# Altium project iMX53_BB_V1I2.PrjPcb (part 1 of 2)
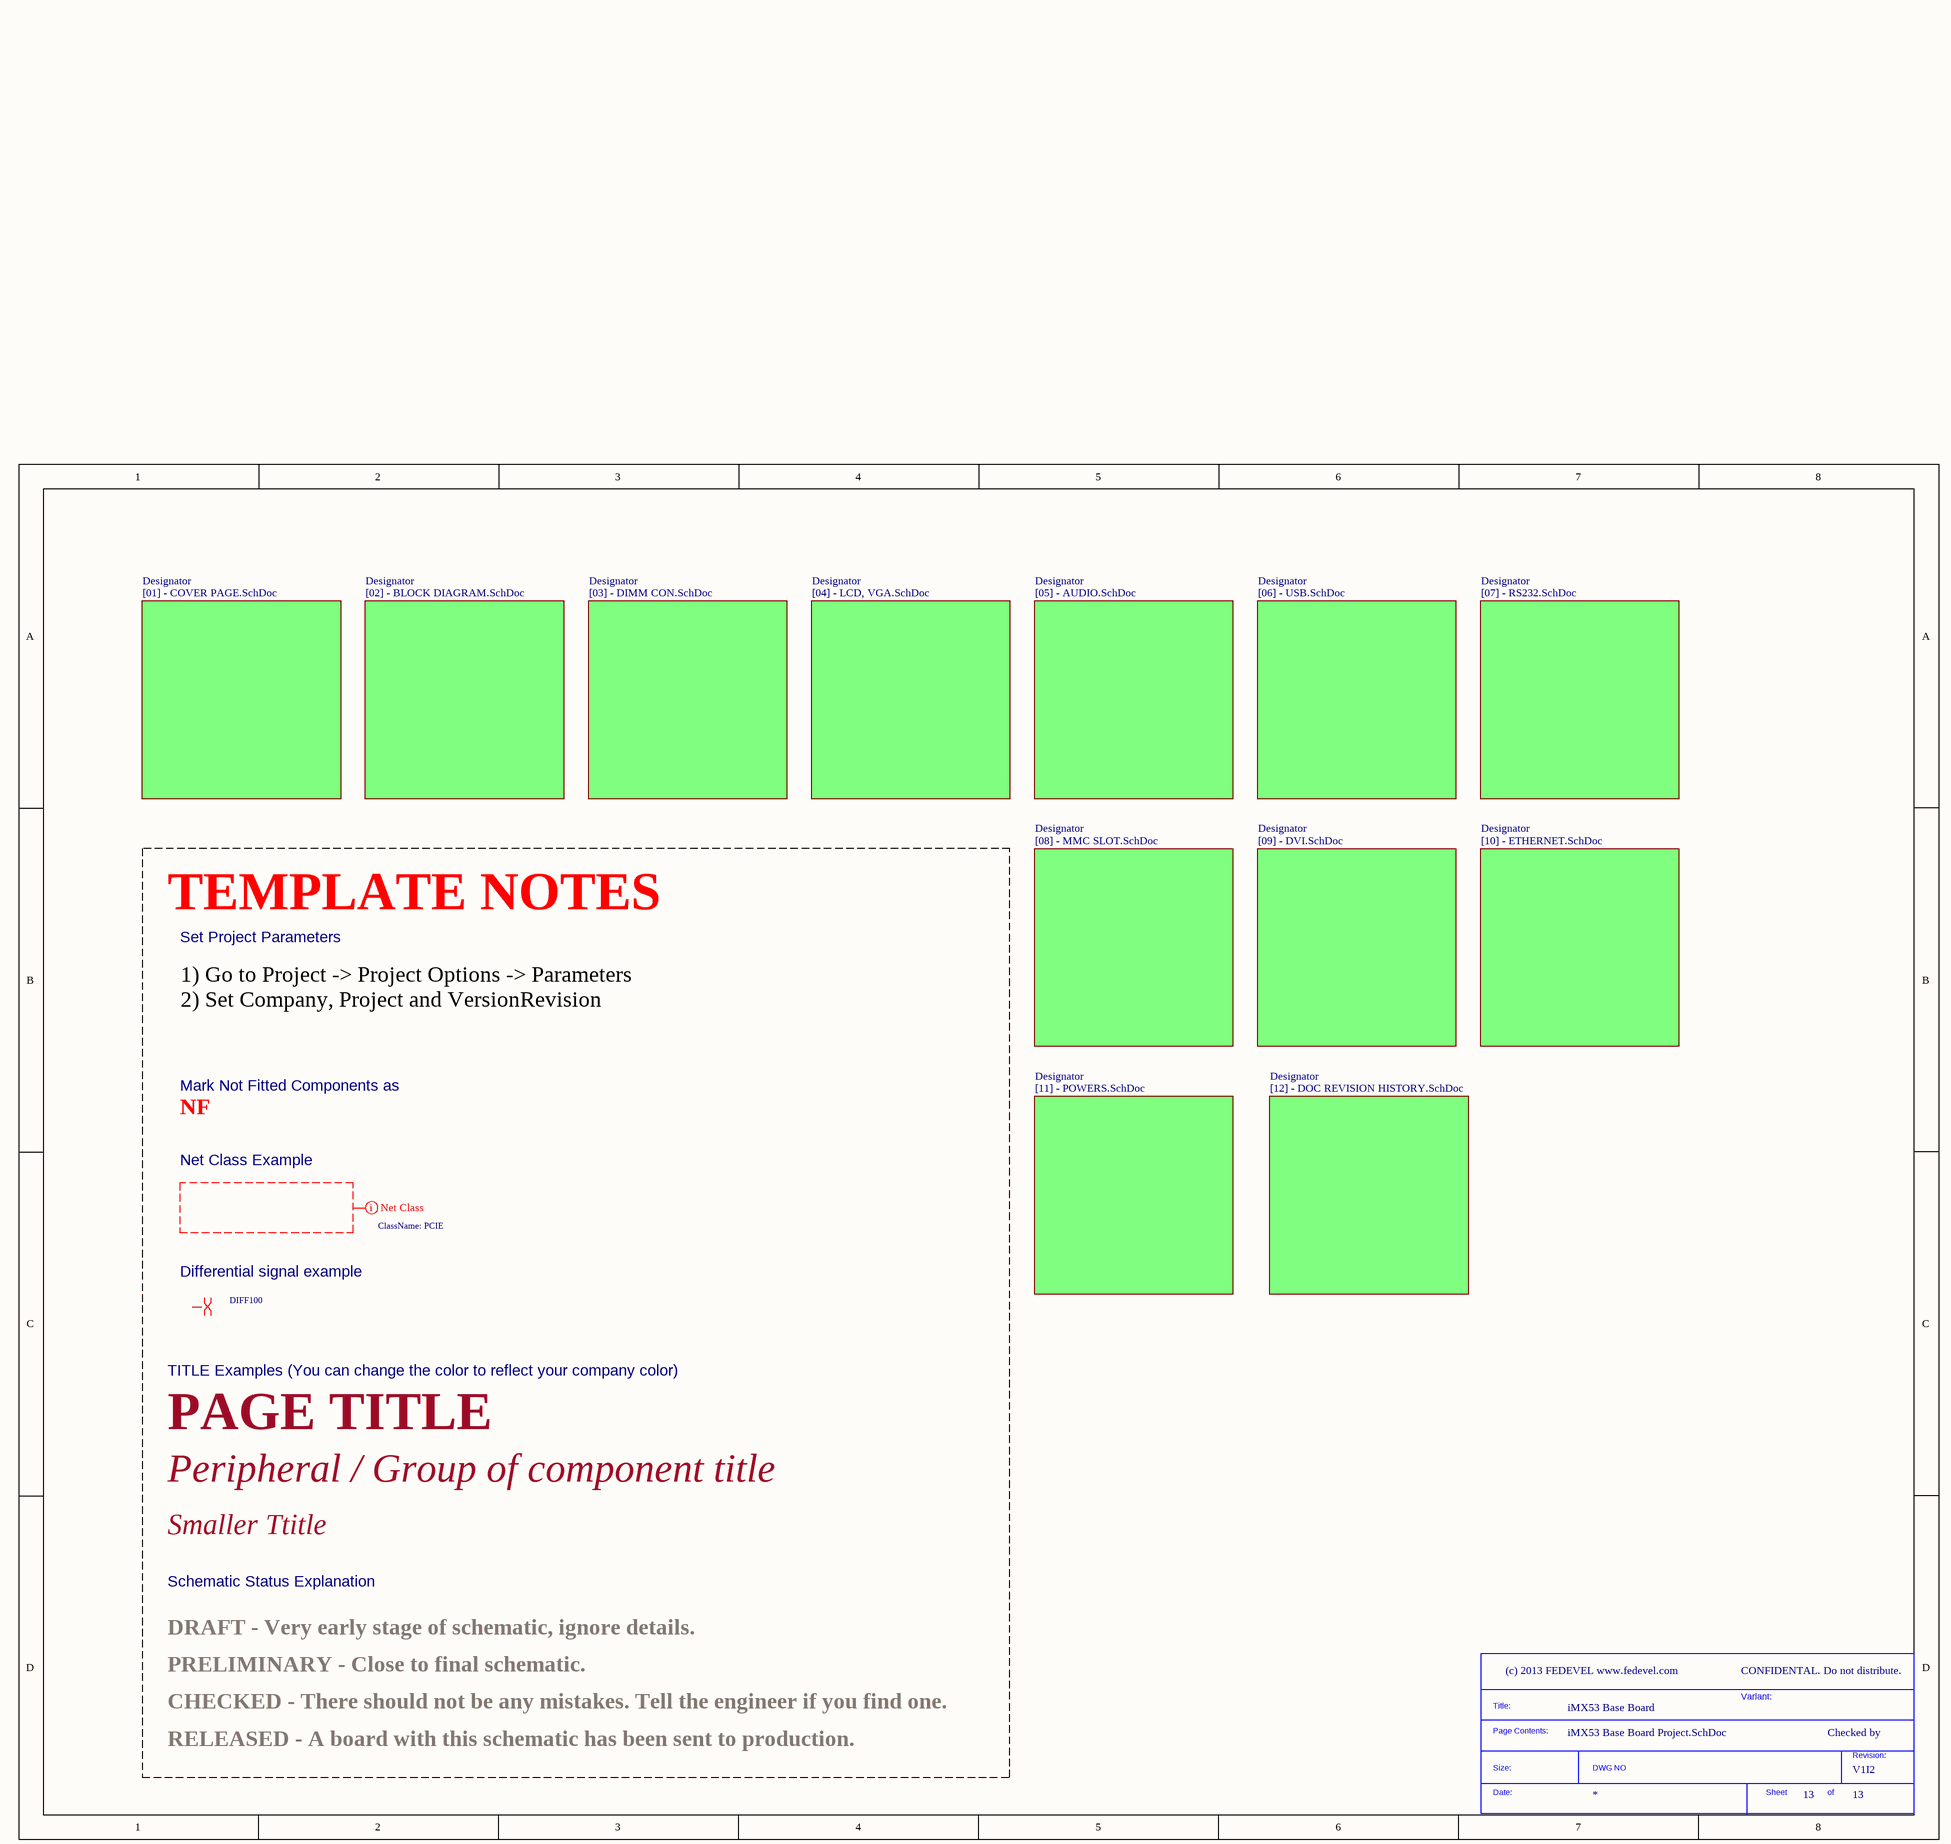
[diagram p0: iMX53 Base Board Project.SchDoc]
Company: (c) 2013 FEDEVEL www.fedevel.com; Project: iMX53 Base Board; VersionRevision: V1I2
13 sheets, 589 parts. Net scope: flat (ports and power ports of the same name join across sheets).
Board file: iMX53_BB_PCB_V1I2.PcbDoc
Sheets:
  iMX53 Base Board Project.SchDoc
    Designator = [01] - COVER PAGE.SchDoc
    Designator = [02] - BLOCK DIAGRAM.SchDoc
    Designator = [03] - DIMM CON.SchDoc
    Designator = [04] - LCD, VGA.SchDoc
    Designator = [05] - AUDIO.SchDoc
    Designator = [06] - USB.SchDoc
    Designator = [07] - RS232.SchDoc
    Designator = [08] - MMC SLOT.SchDoc
    Designator = [09] - DVI.SchDoc
    Designator = [10] - ETHERNET.SchDoc
    Designator = [11] - POWERS.SchDoc
    Designator = [12] - DOC REVISION HISTORY.SchDoc

## Sheet iMX53 Base Board Project.SchDoc
size A3; CompanyName: KDS; Organization: KDS; DocumentNumber: 13; Revision: V1I1; SheetNumber: 13; SheetTotal: 13; PageSetup: Record=PageOptions|CenterHorizontal=True|CenterVertical=True|PrintScale=1.07|XCorrection=1.00|YCorrection=1.00|PrintKind=1|BorderSize=5000000|LeftOffset=0|BottomOffset=0|Orientation=2|PaperLength=1000|PaperWidth=1000|Scale=100|PaperSource=7|PrintQuality=600|MediaType=1|DitherType=10|PaperKind=A3|PrintScaleMode=1; ProjectName: KDS C6A816x Module

### Parts
(Parts that share a designator on the sheet are numbered #1, #2 ... from top to bottom, then left to right.)
*#1  SDTitleBlock  (value not drawn)  (graphical)

### Sub-sheets
Designator = [01] - COVER PAGE.SchDoc: no entries
Designator = [02] - BLOCK DIAGRAM.SchDoc: no entries
Designator = [03] - DIMM CON.SchDoc: no entries
Designator = [04] - LCD, VGA.SchDoc: no entries
Designator = [05] - AUDIO.SchDoc: no entries
Designator = [06] - USB.SchDoc: no entries
Designator = [07] - RS232.SchDoc: no entries
Designator = [08] - MMC SLOT.SchDoc: no entries
Designator = [09] - DVI.SchDoc: no entries
Designator = [10] - ETHERNET.SchDoc: no entries
Designator = [11] - POWERS.SchDoc: no entries
Designator = [12] - DOC REVISION HISTORY.SchDoc: no entries

### Layout directives
net class PCIE: (no net found under the mark)
differential pair; net class DIFF100: (no net found under the mark)

### Notes on the sheet
- TEMPLATE NOTES
- Set Project Parameters
- 1) Go to Project -> Project Options -> Parameters
  2) Set Company, Project and VersionRevision
- NF
- Mark Not Fitted Components as
- Net Class Example
- Differential signal example
- TITLE Examples (You can change the color to reflect your company color)
- PAGE TITLE
- Peripheral / Group of component title
- Smaller Ttitle
- Schematic Status Explanation
- PRELIMINARY - Close to final schematic.
- DRAFT - Very early stage of schematic, ignore details.
- CONFIDENTAL. Do not distribute.
- CHECKED - There should not be any mistakes. Tell the engineer if you find one.
- Variant:
- Checked by
- RELEASED - A board with this schematic has been sent to production.
- (in symbol SDTitleBlock) Title:; Page Contents:; Revision:; Size:; DWG NO; Date:; Sheet; of

## Sheet [01] - COVER PAGE.SchDoc
size A3; DocumentNumber: 1; SheetNumber: 1; SheetTotal: 13
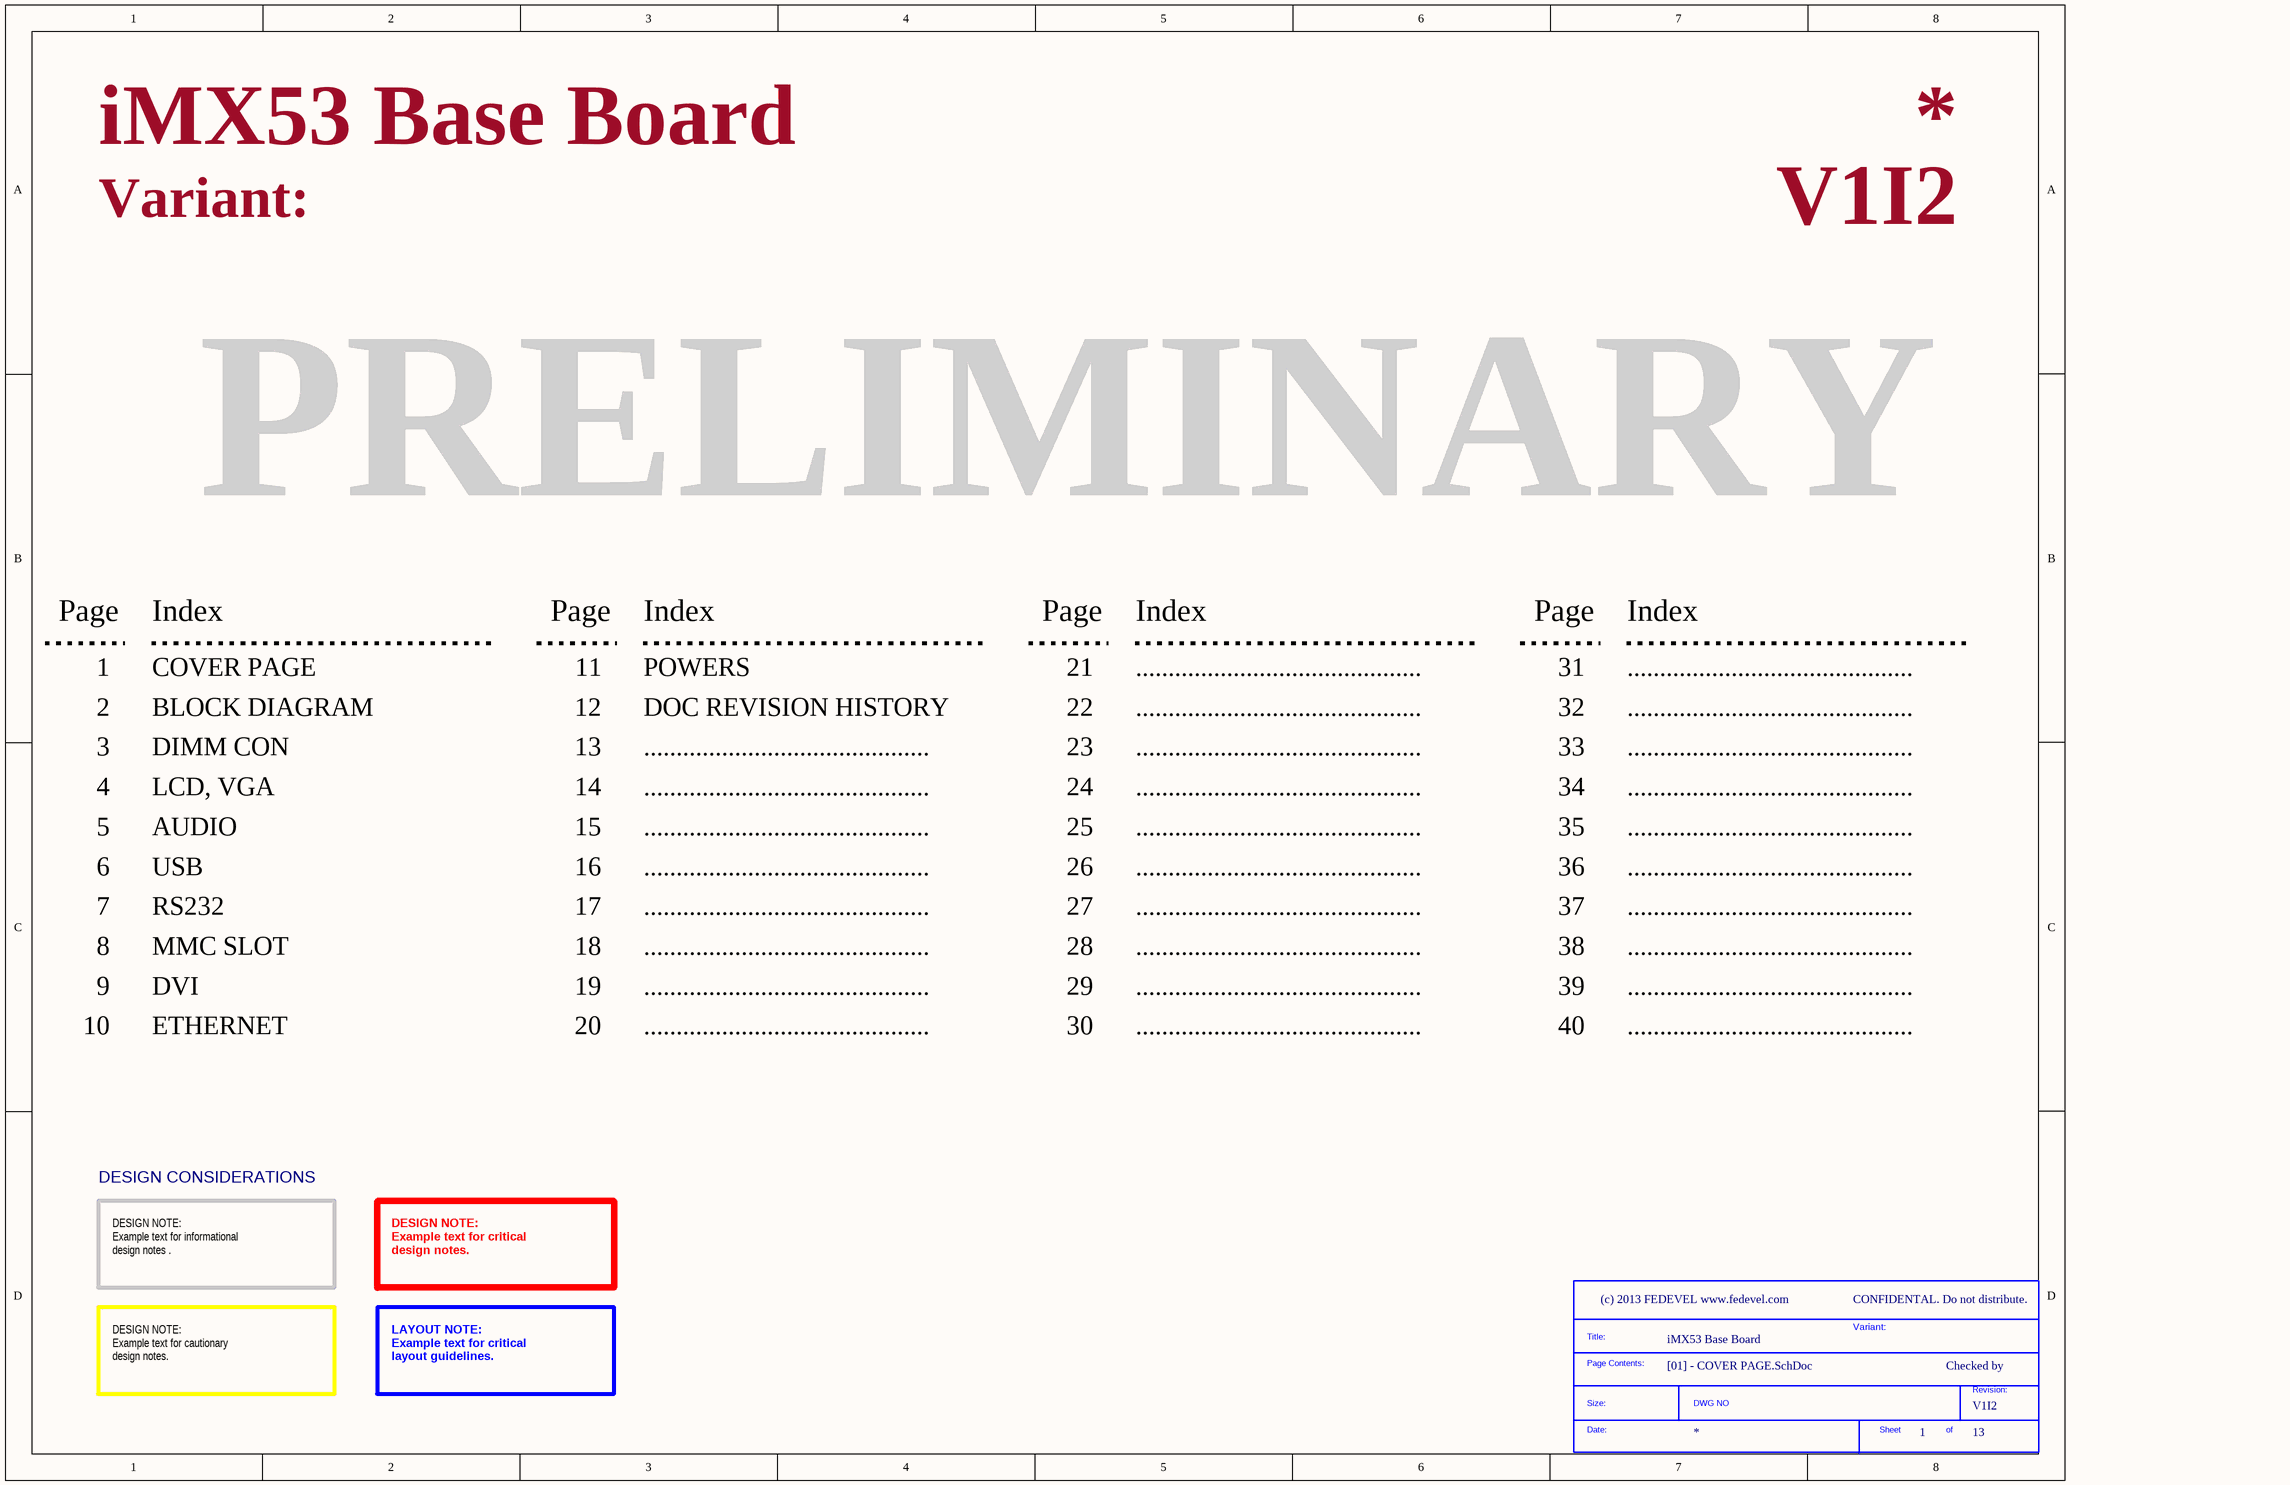
[diagram p1: [01] - COVER PAGE.SchDoc]

### Parts
(Parts that share a designator on the sheet are numbered #1, #2 ... from top to bottom, then left to right.)
*#2  SDTitleBlock  (value not drawn)  (graphical)

### Notes on the sheet
- Variant:
- PRELIMINARY
- Page
- Index
- 1
- COVER PAGE
- 11
- POWERS
- 21
- ............................................
- 31
- 2
- 3
- BLOCK DIAGRAM
- DIMM CON
- 12
- 13
- DOC REVISION HISTORY
- 22
- 23
- 32
- 33
- 4
- 5
- LCD, VGA
- AUDIO
- 14
- 15
- 24
- 25
- 34
- 35
- 6
- USB
- 16
- 26
- 36
- 7
- 8
- RS232
- MMC SLOT
- 17
- 18
- 27
- 28
- 37
- 38
- 9
- 10
- DVI
- ETHERNET
- 19
- 20
- 29
- 30
- 39
- 40
- DESIGN CONSIDERATIONS
- DESIGN NOTE:
  Example text for informational
  design notes .
- DESIGN NOTE:
  Example text for critical
  design notes.
- CONFIDENTAL. Do not distribute.
- Checked by
- DESIGN NOTE:
  Example text for cautionary
  design notes.
- LAYOUT NOTE:
  Example text for critical
  layout guidelines.
- (in symbol SDTitleBlock) Title:; Page Contents:; Revision:; Size:; DWG NO; Date:; Sheet; of

## Sheet [02] - BLOCK DIAGRAM.SchDoc
size A3; DocumentNumber: 2; SheetNumber: 2; SheetTotal: 13
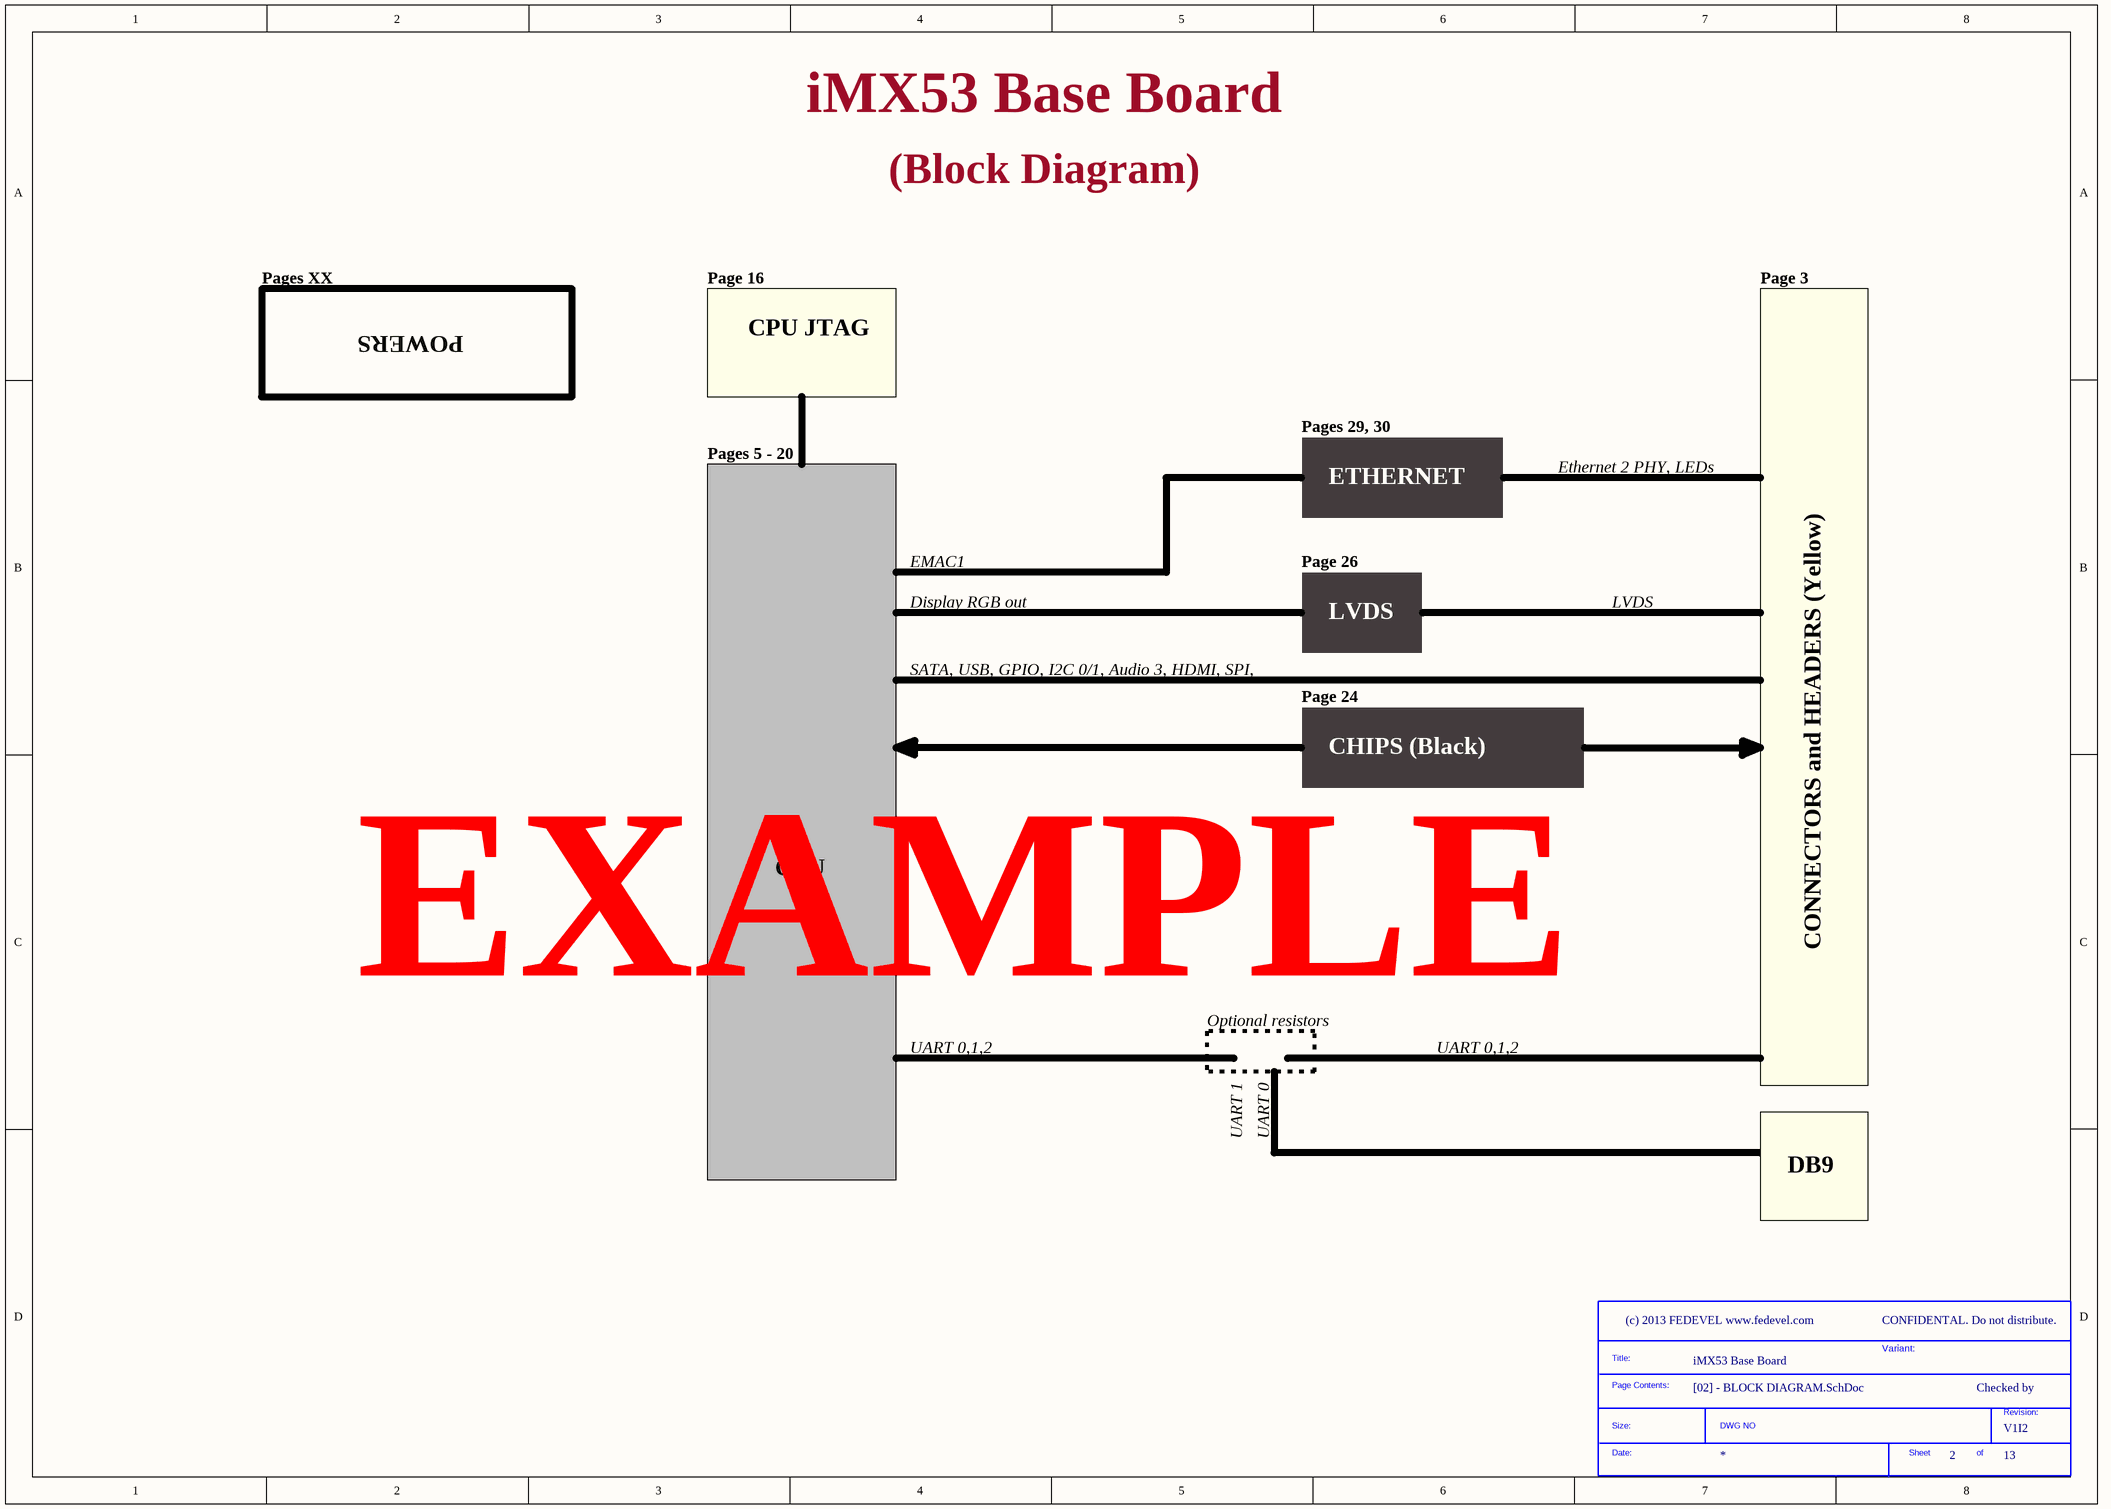
[diagram p2: [02] - BLOCK DIAGRAM.SchDoc]

### Parts
(Parts that share a designator on the sheet are numbered #1, #2 ... from top to bottom, then left to right.)
*#3  SDTitleBlock  (value not drawn)  (graphical)

### Notes on the sheet
- (Block Diagram)
- Pages XX
- Page 16
- Page 3
- POWERS
- CPU JTAG
- Pages 29, 30
- Pages 5 - 20
- ETHERNET
- Ethernet 2 PHY, LEDs
- EMAC1
- Page 26
- Display RGB out
- LVDS
- SATA, USB, GPIO, I2C 0/1, Audio 3, HDMI, SPI,
- Page 24
- CHIPS (Black)
- CPU
- CONNECTORS and HEADERS (Yellow)
- EXAMPLE
- UART 0,1,2
- Optional resistors
- FPGA
- UART 1
- UART 0
- DB9
- CONFIDENTAL. Do not distribute.
- CLOCKS (CPU & PCIE)
- Variant:
- Checked by
- (in symbol SDTitleBlock) Title:; Page Contents:; Revision:; Size:; DWG NO; Date:; Sheet; of

## Sheet [03] - DIMM CON.SchDoc: IMXBB
size A3; DocumentNumber: 3; Revision: 2.0; SheetNumber: 3; SheetTotal: 13
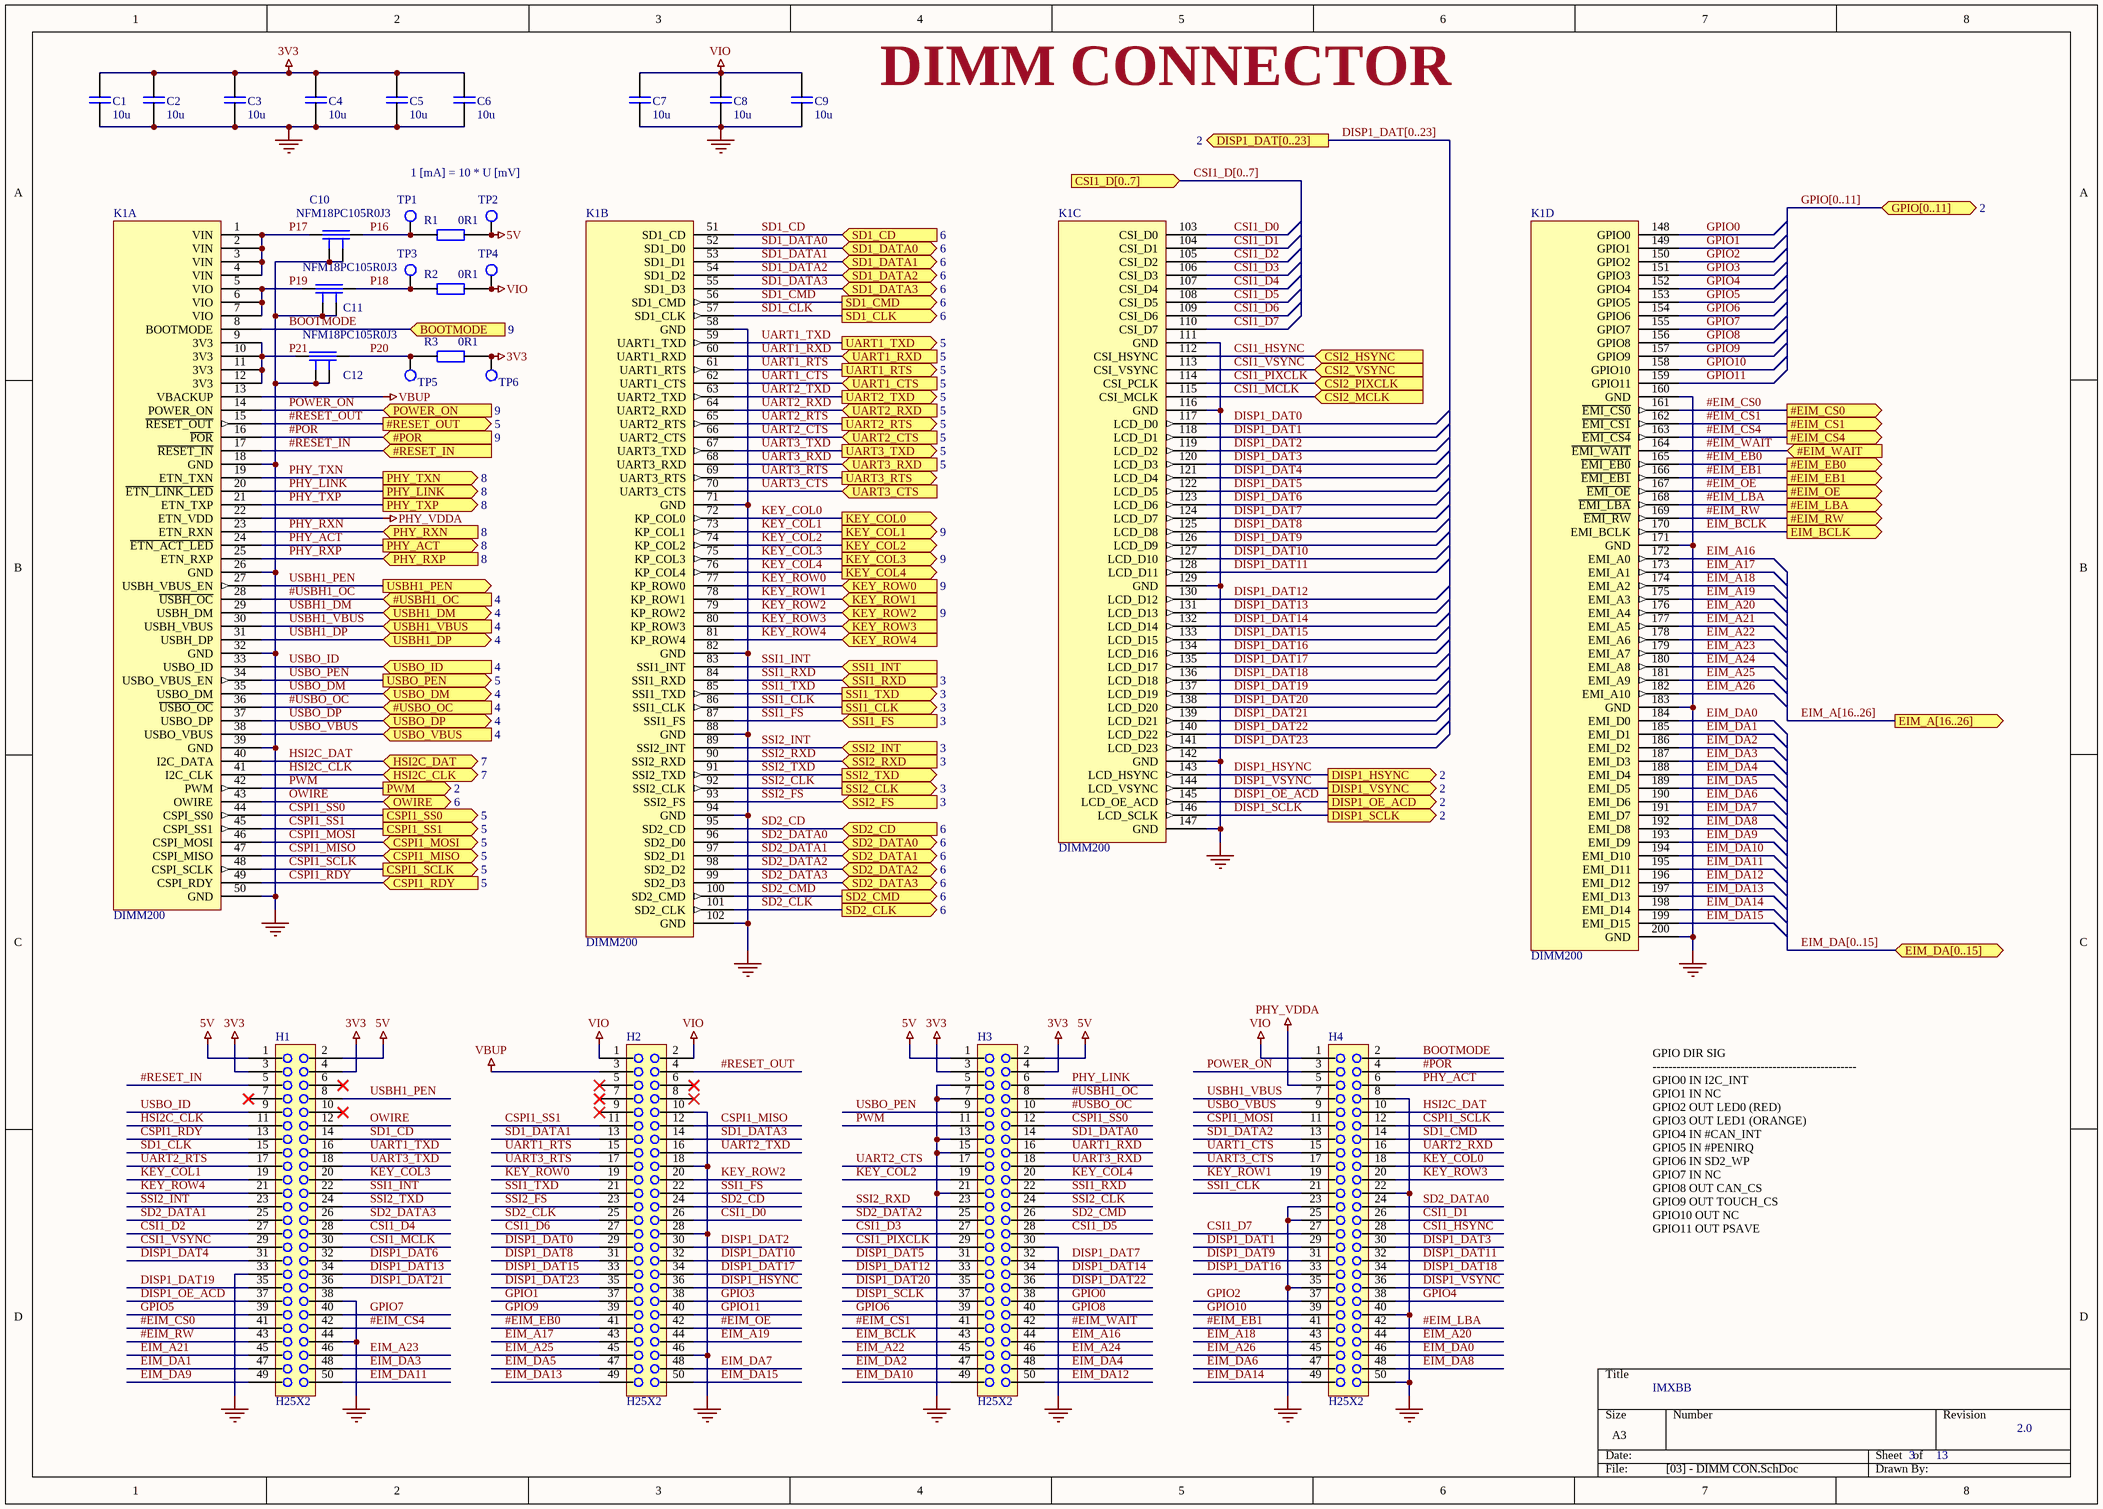
[diagram p3: [03] - DIMM CON.SchDoc]

### Parts
C1  10u  [0805]
C2  10u  [0805]
C3  10u  [0805]
C4  10u  [0805]
C5  10u  [0805]
C6  10u  [0805]
C7  10u  [0805]
C8  10u  [0805]
C9  10u  [0805]
C10  NFM18PC105R0J3  [NFM18P]
C11  NFM18PC105R0J3  [NFM18P]
C12  NFM18PC105R0J3  [NFM18P]
H1  H25X2  [H2x25]
H2  H25X2  [H2x25]
H3  H25X2  [H2x25]
H4  H25X2  [H2x25]
K1  DIMM200  [SODIMM200EDGE]  (parts A,B,C,D of 4)
R1  0R1  [0603]
R2  0R1  [0603]
R3  0R1  [0603]
TP1  TESTPOINT  [TESTPOINT_2mm]  (value not drawn)
TP2  TESTPOINT  [TESTPOINT_2mm]  (value not drawn)
TP3  TESTPOINT  [TESTPOINT_2mm]  (value not drawn)
TP4  TESTPOINT  [TESTPOINT_2mm]  (value not drawn)
TP5  TESTPOINT  [TESTPOINT_2mm]  (value not drawn)
TP6  TESTPOINT  [TESTPOINT_2mm]  (value not drawn)

### Ports
#EIM_CS0 (out), #EIM_CS1 (out), #EIM_CS4 (out), #EIM_EB0 (out), #EIM_EB1 (out), #EIM_LBA (out), #EIM_OE (out), #EIM_RW (out), #EIM_WAIT (in), #POR (in, see 9), #RESET_IN (in), #RESET_OUT (out, see 5), #USBH1_OC (in, see 4), #USBO_OC (in, see 4), BOOTMODE (in, see 9), CSI1_D[0..7] (in), CSI2_HSYNC (in), CSI2_MCLK (in), CSI2_PIXCLK (in), CSI2_VSYNC (in), CSPI1_MISO (bidir, see 5), CSPI1_MOSI (bidir, see 5), CSPI1_RDY (in, see 5), CSPI1_SCLK (out, see 5), CSPI1_SS0 (out, see 5), CSPI1_SS1 (out, see 5), DISP1_DAT[0..23] (out, see 2), DISP1_HSYNC (out, see 2), DISP1_OE_ACD (out, see 2), DISP1_SCLK (out, see 2), DISP1_VSYNC (out, see 2), EIM_A[16..26] (out), EIM_BCLK (out), EIM_DA[0..15] (bidir), GPIO[0..11] (bidir, see 2), HSI2C_CLK (bidir, see 7), HSI2C_DAT (bidir, see 7), KEY_COL0 (out), KEY_COL1 (out, see 9), KEY_COL2 (out), KEY_COL3 (out, see 9), KEY_COL4 (out), KEY_ROW0 (in, see 9), KEY_ROW1 (in), KEY_ROW2 (in, see 9), KEY_ROW3 (in), KEY_ROW4 (in), OWIRE (bidir, see 6), PHY_ACT (out, see 8), PHY_LINK (out, see 8), PHY_RXN (in, see 8), PHY_RXP (in, see 8), PHY_TXN (out, see 8), PHY_TXP (out, see 8), POWER_ON (in, see 9), PWM (out, see 2), SD1_CD (in, see 6), SD1_CLK (out, see 6), SD1_CMD (out, see 6), SD1_DATA0 (bidir, see 6), SD1_DATA1 (bidir, see 6), SD1_DATA2 (bidir, see 6), SD1_DATA3 (bidir, see 6), SD2_CD (in, see 6), SD2_CLK (out, see 6), SD2_CMD (out, see 6), SD2_DATA0 (bidir, see 6), SD2_DATA1 (bidir, see 6), SD2_DATA2 (bidir, see 6), SD2_DATA3 (bidir, see 6), SSI1_CLK (out, see 3), SSI1_FS (in, see 3), SSI1_INT (in), SSI1_RXD (in, see 3), SSI1_TXD (out, see 3), SSI2_CLK (out, see 3), SSI2_FS (in, see 3), SSI2_INT (in, see 3), SSI2_RXD (in, see 3), SSI2_TXD (out), UART1_CTS (in, see 5), UART1_RTS (out, see 5), UART1_RXD (in, see 5), UART1_TXD (out, see 5), UART2_CTS (in, see 5), UART2_RTS (out, see 5), UART2_RXD (in, see 5), UART2_TXD (out, see 5), UART3_CTS (in), UART3_RTS (out), UART3_RXD (in, see 5), UART3_TXD (out, see 5), USBH1_DM (bidir, see 4), USBH1_DP (bidir, see 4), USBH1_PEN (out), USBH1_VBUS (in, see 4), USBO_DM (bidir, see 4), USBO_DP (bidir, see 4), USBO_ID (in, see 4), USBO_PEN (out, see 5), USBO_VBUS (in, see 4)

### Nets
3V3: C1.2 C2.2 C3.2 C4.2 C5.2 C6.2 H1.3 H1.4 H3.3 H3.4 R3.2 TP6.1
5V: H1.1 H1.2 H3.1 H3.2 R1.2 TP2.1
GND: C1.1 C2.1 C3.1 C4.1 C5.1 C6.1 C7.1 C8.1 C9.1 C10.2 C10.4 C11.2 C11.4 C12.2 C12.4 H1.33 H1.38 H1.44 H2.10 H2.18 H2.28 H2.46 H3.5 H3.7 H3.13 H3.15 H3.21 H3.30 H4.8 H4.22 H4.23 H4.25 H4.35 H4.40 H4.50 K1.18(GND) K1.26(GND) K1.32(GND) K1.39(GND) K1.50(GND) K1.58(GND) K1.71(GND) K1.82(GND) K1.88(GND) K1.94(GND) K1.102(GND) K1.111(GND) K1.116(GND) K1.129(GND) K1.142(GND) K1.147(GND) K1.160(GND) K1.171(GND) K1.183(GND) K1.200(GND)
PHY_VDDA: H4.5 K1.22(ETN_VDD)
VBUP: H2.3 K1.13(VBACKUP)
VIO: C7.2 C8.2 C9.2 H2.1 H2.2 H4.1 R2.2 TP4.1
#EIM_CS0: H1.41 K1.161(~{EMI_CS0}) ; port #EIM_CS0
#EIM_CS1: H3.41 K1.162(~{EMI_CS1}) ; port #EIM_CS1
#EIM_CS4: H1.42 K1.163(~{EMI_CS4}) ; port #EIM_CS4
#EIM_EB0: H2.41 K1.165(~{EMI_EB0}) ; port #EIM_EB0
#EIM_EB1: H4.41 K1.166(~{EMI_EB1}) ; port #EIM_EB1
#EIM_LBA: H4.42 K1.168(~{EMI_LBA}) ; port #EIM_LBA
#EIM_OE: H2.42 K1.167(~{EMI_OE}) ; port #EIM_OE
#EIM_RW: H1.43 K1.169(~{EMI_RW}) ; port #EIM_RW
#EIM_WAIT: H3.42 K1.164(~{EMI_WAIT}) ; port #EIM_WAIT
#POR: H4.4 K1.16(~{POR}) ; port #POR
#RESET_IN: H1.5 K1.17(~{RESET_IN}) ; port #RESET_IN
#RESET_OUT: H2.4 K1.15(~{RESET_OUT}) ; port #RESET_OUT
#USBH1_OC: H3.8 K1.28(~{USBH_OC}) ; port #USBH1_OC
#USBO_OC: H3.10 K1.36(~{USBO_OC}) ; port #USBO_OC
BOOTMODE: H4.2 K1.8(BOOTMODE) ; port BOOTMODE
CSI1_D0: H2.26 K1.103(CSI_D0)
CSI1_D1: H4.26 K1.104(CSI_D1)
CSI1_D2: H1.27 K1.105(CSI_D2)
CSI1_D3: H3.27 K1.106(CSI_D3)
CSI1_D4: H1.28 K1.107(CSI_D4)
CSI1_D5: H3.28 K1.108(CSI_D5)
CSI1_D6: H2.27 K1.109(CSI_D6)
CSI1_D7: H4.27 K1.110(CSI_D7)
CSI1_HSYNC: H4.28 K1.112(CSI_HSYNC) ; port CSI2_HSYNC
CSI1_MCLK: H1.30 K1.115(CSI_MCLK) ; port CSI2_MCLK
CSI1_PIXCLK: H3.29 K1.114(CSI_PCLK) ; port CSI2_PIXCLK
CSI1_VSYNC: H1.29 K1.113(CSI_VSYNC) ; port CSI2_VSYNC
CSPI1_MISO: H2.12 K1.47(CSPI_MISO) ; port CSPI1_MISO
CSPI1_MOSI: H4.11 K1.46(CSPI_MOSI) ; port CSPI1_MOSI
CSPI1_RDY: H1.13 K1.49(CSPI_RDY) ; port CSPI1_RDY
CSPI1_SCLK: H4.12 K1.48(CSPI_SCLK) ; port CSPI1_SCLK
CSPI1_SS0: H3.12 K1.44(CSPI_SS0) ; port CSPI1_SS0
CSPI1_SS1: H2.11 K1.45(CSPI_SS1) ; port CSPI1_SS1
DISP1_DAT0: H2.29 K1.117(LCD_D0)
DISP1_DAT1: H4.29 K1.118(LCD_D1)
DISP1_DAT2: H2.30 K1.119(LCD_D2)
DISP1_DAT3: H4.30 K1.120(LCD_D3)
DISP1_DAT4: H1.31 K1.121(LCD_D4)
DISP1_DAT5: H3.31 K1.122(LCD_D5)
DISP1_DAT6: H1.32 K1.123(LCD_D6)
DISP1_DAT7: H3.32 K1.124(LCD_D7)
DISP1_DAT8: H2.31 K1.125(LCD_D8)
DISP1_DAT9: H4.31 K1.126(LCD_D9)
DISP1_DAT10: H2.32 K1.127(LCD_D10)
DISP1_DAT11: H4.32 K1.128(LCD_D11)
DISP1_DAT12: H3.33 K1.130(LCD_D12)
DISP1_DAT13: H1.34 K1.131(LCD_D13)
DISP1_DAT14: H3.34 K1.132(LCD_D14)
DISP1_DAT15: H2.33 K1.133(LCD_D15)
DISP1_DAT16: H4.33 K1.134(LCD_D16)
DISP1_DAT17: H2.34 K1.135(LCD_D17)
DISP1_DAT18: H4.34 K1.136(LCD_D18)
DISP1_DAT19: H1.35 K1.137(LCD_D19)
DISP1_DAT20: H3.35 K1.138(LCD_D20)
DISP1_DAT21: H1.36 K1.139(LCD_D21)
DISP1_DAT22: H3.36 K1.140(LCD_D22)
DISP1_DAT23: H2.35 K1.141(LCD_D23)
DISP1_HSYNC: H2.36 K1.143(LCD_HSYNC) ; port DISP1_HSYNC
DISP1_OE_ACD: H1.37 K1.145(LCD_OE_ACD) ; port DISP1_OE_ACD
DISP1_SCLK: H3.37 K1.146(LCD_SCLK) ; port DISP1_SCLK
DISP1_VSYNC: H4.36 K1.144(LCD_VSYNC) ; port DISP1_VSYNC
EIM_A16: H3.44 K1.172(EMI_A0)
EIM_A17: H2.43 K1.173(EMI_A1)
EIM_A18: H4.43 K1.174(EMI_A2)
EIM_A19: H2.44 K1.175(EMI_A3)
EIM_A20: H4.44 K1.176(EMI_A4)
EIM_A21: H1.45 K1.177(EMI_A5)
EIM_A22: H3.45 K1.178(EMI_A6)
EIM_A23: H1.46 K1.179(EMI_A7)
EIM_A24: H3.46 K1.180(EMI_A8)
EIM_A25: H2.45 K1.181(EMI_A9)
EIM_A26: H4.45 K1.182(EMI_A10)
EIM_BCLK: H3.43 K1.170(EMI_BCLK) ; port EIM_BCLK
EIM_DA0: H4.46 K1.184(EMI_D0)
EIM_DA1: H1.47 K1.185(EMI_D1)
EIM_DA2: H3.47 K1.186(EMI_D2)
EIM_DA3: H1.48 K1.187(EMI_D3)
EIM_DA4: H3.48 K1.188(EMI_D4)
EIM_DA5: H2.47 K1.189(EMI_D5)
EIM_DA6: H4.47 K1.190(EMI_D6)
EIM_DA7: H2.48 K1.191(EMI_D7)
EIM_DA8: H4.48 K1.192(EMI_D8)
EIM_DA9: H1.49 K1.193(EMI_D9)
EIM_DA10: H3.49 K1.194(EMI_D10)
EIM_DA11: H1.50 K1.195(EMI_D11)
EIM_DA12: H3.50 K1.196(EMI_D12)
EIM_DA13: H2.49 K1.197(EMI_D13)
EIM_DA14: H4.49 K1.198(EMI_D14)
EIM_DA15: H2.50 K1.199(EMI_D15)
GPIO0: H3.38 K1.148(GPIO0)
GPIO1: H2.37 K1.149(GPIO1)
GPIO2: H4.37 K1.150(GPIO2)
GPIO3: H2.38 K1.151(GPIO3)
GPIO4: H4.38 K1.152(GPIO4)
GPIO5: H1.39 K1.153(GPIO5)
GPIO6: H3.39 K1.154(GPIO6)
GPIO7: H1.40 K1.155(GPIO7)
GPIO8: H3.40 K1.156(GPIO8)
GPIO9: H2.39 K1.157(GPIO9)
GPIO10: H4.39 K1.158(GPIO10)
GPIO11: H2.40 K1.159(GPIO11)
HSI2C_CLK: H1.11 K1.41(I2C_CLK) ; port HSI2C_CLK
HSI2C_DAT: H4.10 K1.40(I2C_DATA) ; port HSI2C_DAT
KEY_COL0: H4.18 K1.72(KP_COL0) ; port KEY_COL0
KEY_COL1: H1.19 K1.73(KP_COL1) ; port KEY_COL1
KEY_COL2: H3.19 K1.74(KP_COL2) ; port KEY_COL2
KEY_COL3: H1.20 K1.75(KP_COL3) ; port KEY_COL3
KEY_COL4: H3.20 K1.76(KP_COL4) ; port KEY_COL4
KEY_ROW0: H2.19 K1.77(KP_ROW0) ; port KEY_ROW0
KEY_ROW1: H4.19 K1.78(KP_ROW1) ; port KEY_ROW1
KEY_ROW2: H2.20 K1.79(KP_ROW2) ; port KEY_ROW2
KEY_ROW3: H4.20 K1.80(KP_ROW3) ; port KEY_ROW3
KEY_ROW4: H1.21 K1.81(KP_ROW4) ; port KEY_ROW4
OWIRE: H1.12 K1.43(OWIRE) ; port OWIRE
P16: C10.3 R1.1 TP1.1
P17: C10.1 K1.1(VIN) K1.2(VIN) K1.3(VIN) K1.4(VIN)
P18: C11.3 R2.1 TP3.1
P19: C11.1 K1.5(VIO) K1.6(VIO) K1.7(VIO)
P20: C12.3 R3.1 TP5.1
P21: C12.1 K1.9(3V3) K1.10(3V3) K1.11(3V3) K1.12(3V3)
PHY_ACT: H4.6 K1.24(~{ETN_ACT_LED}) ; port PHY_ACT
PHY_LINK: H3.6 K1.20(~{ETN_LINK_LED}) ; port PHY_LINK
PHY_RXN: K1.23(ETN_RXN) ; port PHY_RXN
PHY_RXP: K1.25(ETN_RXP) ; port PHY_RXP
PHY_TXN: K1.19(ETN_TXN) ; port PHY_TXN
PHY_TXP: K1.21(ETN_TXP) ; port PHY_TXP
POWER_ON: H4.3 K1.14(POWER_ON) ; port POWER_ON
PWM: H3.11 K1.42(PWM) ; port PWM
SD1_CD: H1.14 K1.51(SD1_CD) ; port SD1_CD
SD1_CLK: H1.15 K1.57(SD1_CLK) ; port SD1_CLK
SD1_CMD: H4.14 K1.56(SD1_CMD) ; port SD1_CMD
SD1_DATA0: H3.14 K1.52(SD1_D0) ; port SD1_DATA0
SD1_DATA1: H2.13 K1.53(SD1_D1) ; port SD1_DATA1
SD1_DATA2: H4.13 K1.54(SD1_D2) ; port SD1_DATA2
SD1_DATA3: H2.14 K1.55(SD1_D3) ; port SD1_DATA3
SD2_CD: H2.24 K1.95(SD2_CD) ; port SD2_CD
SD2_CLK: H2.25 K1.101(SD2_CLK) ; port SD2_CLK
SD2_CMD: H3.26 K1.100(SD2_CMD) ; port SD2_CMD
SD2_DATA0: H4.24 K1.96(SD2_D0) ; port SD2_DATA0
SD2_DATA1: H1.25 K1.97(SD2_D1) ; port SD2_DATA1
SD2_DATA2: H3.25 K1.98(SD2_D2) ; port SD2_DATA2
SD2_DATA3: H1.26 K1.99(SD2_D3) ; port SD2_DATA3
SSI1_CLK: H4.21 K1.86(SSI1_CLK) ; port SSI1_CLK
SSI1_FS: H2.22 K1.87(SSI1_FS) ; port SSI1_FS
SSI1_INT: H1.22 K1.83(SSI1_INT) ; port SSI1_INT
SSI1_RXD: H3.22 K1.84(SSI1_RXD) ; port SSI1_RXD
SSI1_TXD: H2.21 K1.85(SSI1_TXD) ; port SSI1_TXD
SSI2_CLK: H3.24 K1.92(SSI2_CLK) ; port SSI2_CLK
SSI2_FS: H2.23 K1.93(SSI2_FS) ; port SSI2_FS
SSI2_INT: H1.23 K1.89(SSI2_INT) ; port SSI2_INT
SSI2_RXD: H3.23 K1.90(SSI2_RXD) ; port SSI2_RXD
SSI2_TXD: H1.24 K1.91(SSI2_TXD) ; port SSI2_TXD
UART1_CTS: H4.15 K1.62(UART1_CTS) ; port UART1_CTS
UART1_RTS: H2.15 K1.61(UART1_RTS) ; port UART1_RTS
UART1_RXD: H3.16 K1.60(UART1_RXD) ; port UART1_RXD
UART1_TXD: H1.16 K1.59(UART1_TXD) ; port UART1_TXD
UART2_CTS: H3.17 K1.66(UART2_CTS) ; port UART2_CTS
UART2_RTS: H1.17 K1.65(UART2_RTS) ; port UART2_RTS
UART2_RXD: H4.16 K1.64(UART2_RXD) ; port UART2_RXD
UART2_TXD: H2.16 K1.63(UART2_TXD) ; port UART2_TXD
UART3_CTS: H4.17 K1.70(UART3_CTS) ; port UART3_CTS
UART3_RTS: H2.17 K1.69(UART3_RTS) ; port UART3_RTS
UART3_RXD: H3.18 K1.68(UART3_RXD) ; port UART3_RXD
UART3_TXD: H1.18 K1.67(UART3_TXD) ; port UART3_TXD
USBH1_DM: K1.29(USBH_DM) ; port USBH1_DM
USBH1_DP: K1.31(USBH_DP) ; port USBH1_DP
USBH1_PEN: H1.8 K1.27(USBH_VBUS_EN) ; port USBH1_PEN
USBH1_VBUS: H4.7 K1.30(USBH_VBUS) ; port USBH1_VBUS
USBO_DM: K1.35(USBO_DM) ; port USBO_DM  [project net USBO_D_N]
USBO_DP: K1.37(USBO_DP) ; port USBO_DP  [project net USBO_D_P]
USBO_ID: H1.9 K1.33(USBO_ID) ; port USBO_ID
USBO_PEN: H3.9 K1.34(USBO_VBUS_EN) ; port USBO_PEN
USBO_VBUS: H4.9 K1.38(USBO_VBUS) ; port USBO_VBUS

Not connected (* = marked no-connect by the designer): H1 6* 7* 10*; H2 5* 6* 7* 8* 9*

### Buses and harness runs
bus CSI1_D[0..7] = port CSI1_D[0..7]
bus DISP1_DAT[0..23] = port DISP1_DAT[0..23]
bus EIM_A[16..26] = port EIM_A[16..26]
bus EIM_DA[0..15] = port EIM_DA[0..15]
bus GPIO[0..11] = port GPIO[0..11]

### Notes on the sheet
- DIMM CONNECTOR
- 1 [mA] = 10 * U [mV]
- GPIO	DIR	SIG
  ---------------------------------------------------
  GPIO0	IN	I2C_INT
  GPIO1	IN	NC
  GPIO2	OUT	LED0 (RED)
  GPIO3	OUT	LED1 (ORANGE)
  GPIO4	IN	#CAN_INT
  GPIO5	IN	#PENIRQ
  GPIO6	IN	SD2_WP
  GPIO7	IN	NC
  GPIO8	OUT	CAN_CS
  GPIO9	OUT	TOUCH_CS
  GPIO10	OUT	NC
  GPIO11	OUT	PSAVE

### Library data of the parts
C1-C9 = C
C10-C12 = NFL21S: Chip EMIFIL; Producer: Murata; Order number: NFM18PC105R0J3; Component class: C; Assembly type: SMT
R1-R3 = R
TP1-TP6 = TESTPOINT: Testpoint pad; Order number: no component; Component class: TP; Producer: n/a; Assembly type: no component

## Sheet [04] - LCD, VGA.SchDoc: IMXBB
size A3; DocumentNumber: 4; Revision: 2.0; SheetNumber: 4; SheetTotal: 13
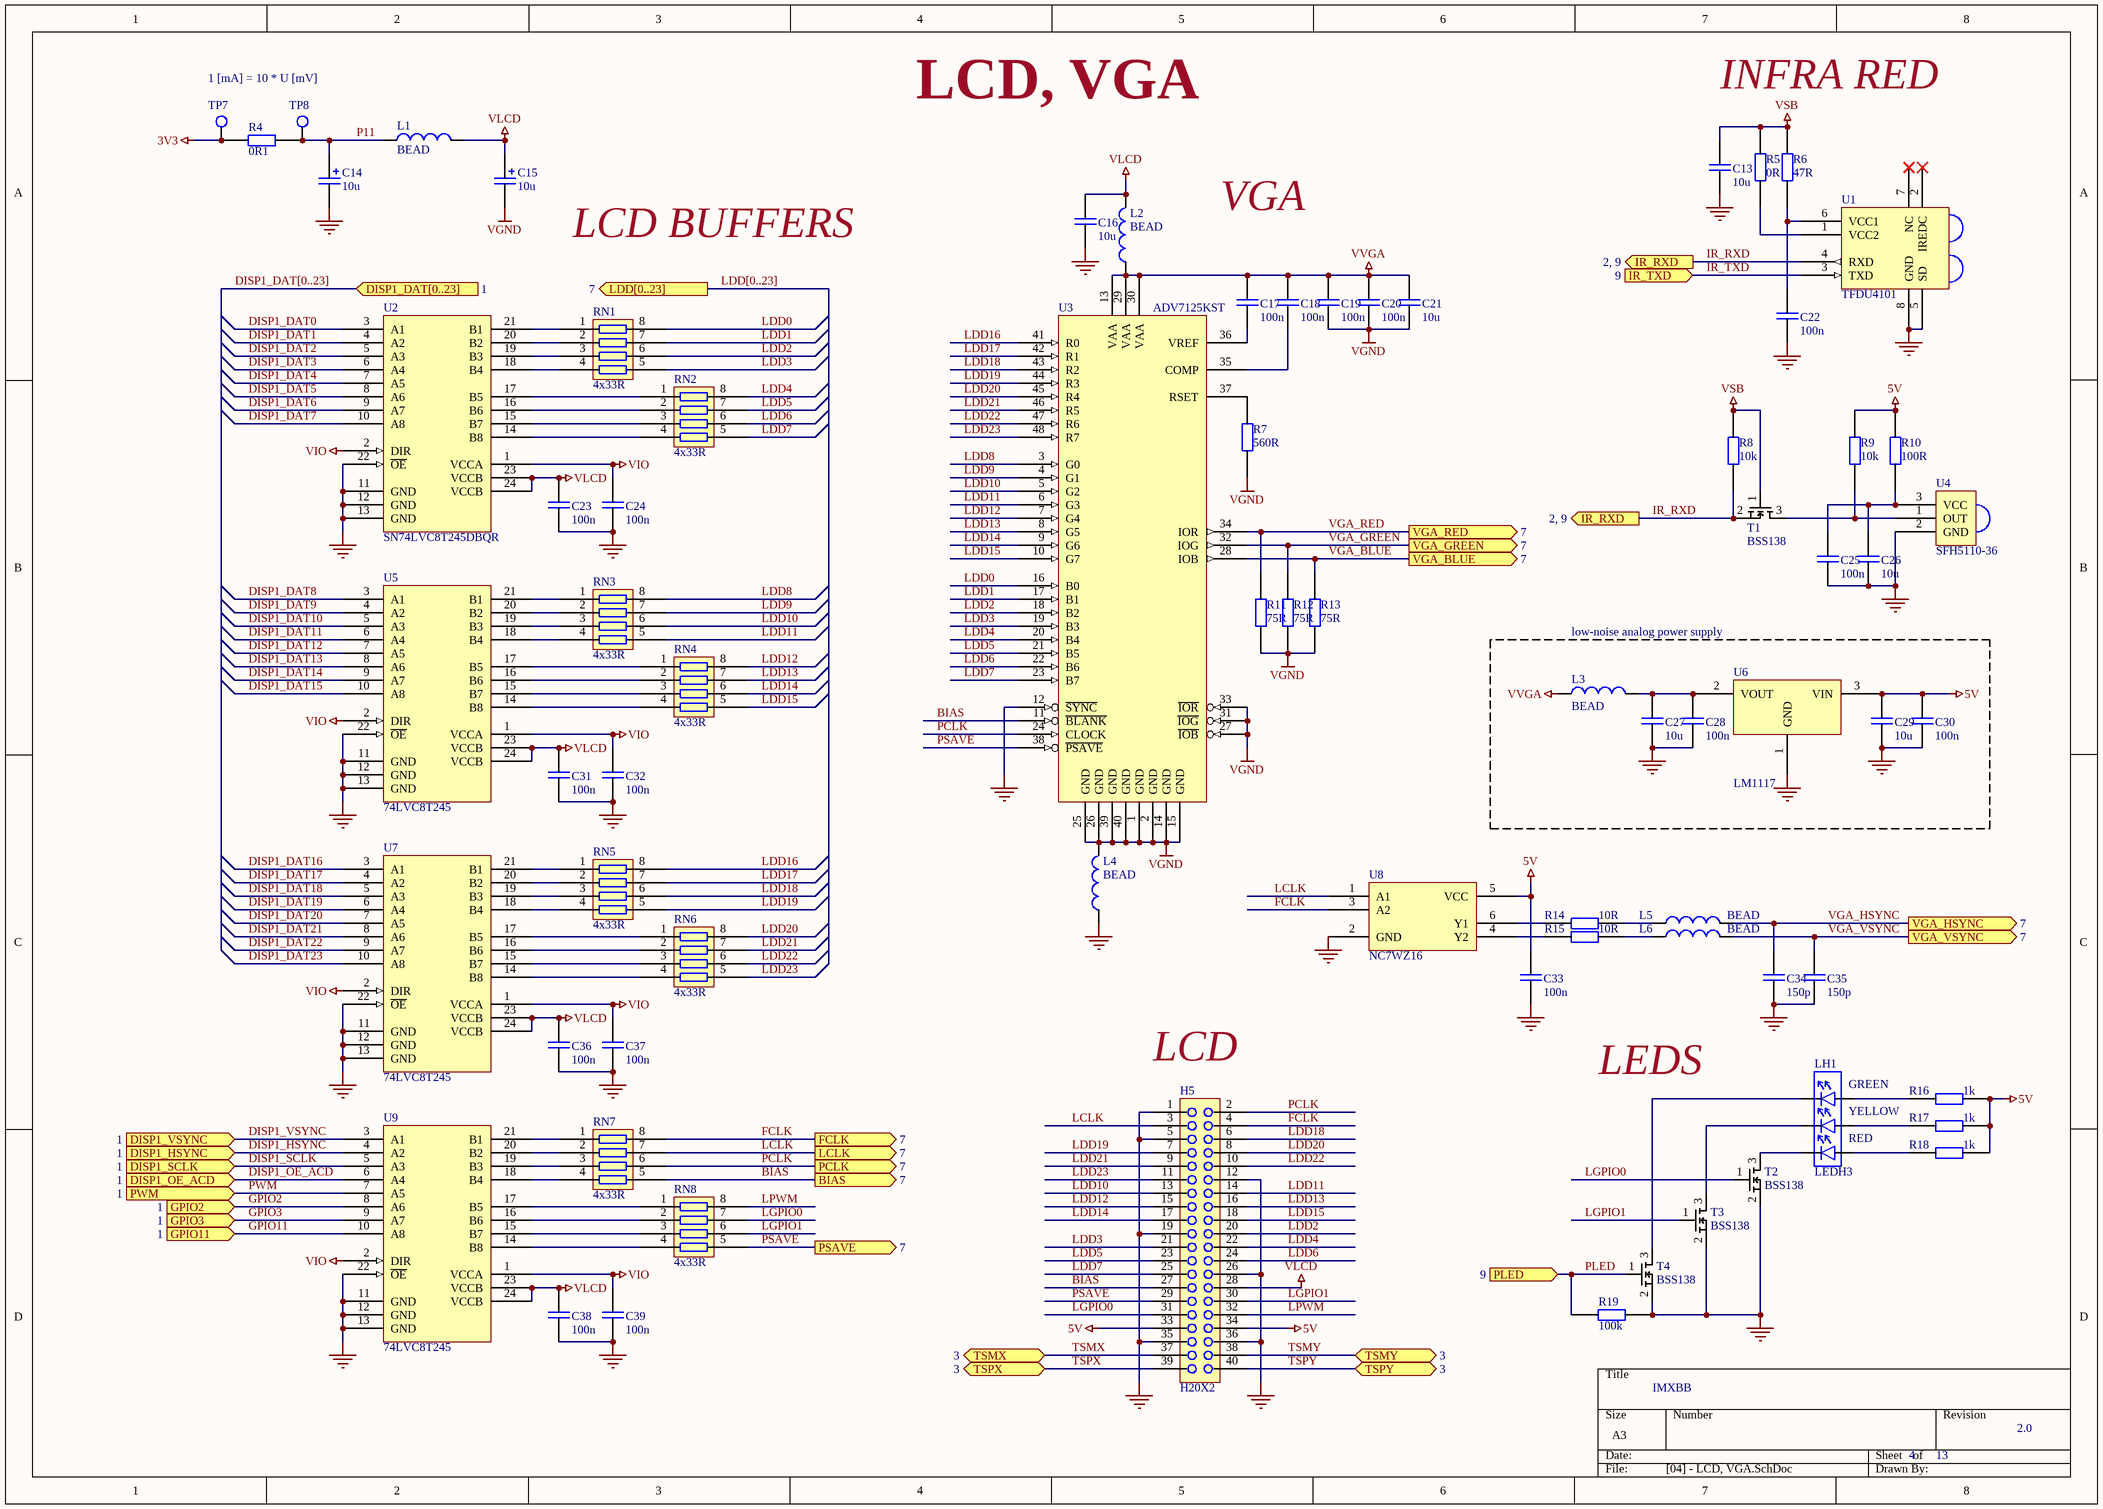
[diagram p4: [04] - LCD, VGA.SchDoc]

### Parts
C13  10u  [0805]
C14  10u  [3216A]
C15  10u  [3216A]
C16  10u  [0805]
C17  100n  [0603]
C18  100n  [0603]
C19  100n  [0603]
C20  100n  [0603]
C21  10u  [0805]
C22  100n  [0603]
C23  100n  [0603]
C24  100n  [0603]
C25  100n  [0603]
C26  10u  [0805]
C27  10u  [0805]
C28  100n  [0603]
C29  10u  [0805]
C30  100n  [0603]
C31  100n  [0603]
C32  100n  [0603]
C33  100n  [0603]
C34  150p  [0603]
C35  150p  [0603]
C36  100n  [0603]
C37  100n  [0603]
C38  100n  [0603]
C39  100n  [0603]
H5  H20X2  [H2x20]
L1  BEAD  [0603]
L2  BEAD  [0603]
L3  BEAD  [0603]
L4  BEAD  [0603]
L5  BEAD  [0603]
L6  BEAD  [0603]
LH1  LEDH3  [LED HOLDER 3]
R4  0R1  [0603]
R5  0R  [0603]
R6  47R  [0603]
R7  560R  [0603]
R8  10k  [0603]
R9  10k  [0603]
R10  100R  [0603]
R11  75R  [0603]
R12  75R  [0603]
R13  75R  [0603]
R14  10R  [0603]
R15  10R  [0603]
R16  1k  [0603]
R17  1k  [0603]
R18  1k  [0603]
R19  100k  [0603]
RN1  4x33R  [RX4_NS]
RN2  4x33R  [RX4_NS]
RN3  4x33R  [RX4_NS]
RN4  4x33R  [RX4_NS]
RN5  4x33R  [RX4_NS]
RN6  4x33R  [RX4_NS]
RN7  4x33R  [RX4_NS]
RN8  4x33R  [RX4_NS]
T1  BSS138  [SOT23]
T2  BSS138  [SOT23]
T3  BSS138  [SOT23]
T4  BSS138  [SOT23]
TP7  TESTPOINT  [TESTPOINT_2mm]  (value not drawn)
TP8  TESTPOINT  [TESTPOINT_2mm]  (value not drawn)
U1  TFDU4101  [TDFU4101]
U2  SN74LVC8T245DBQR
U3  ADV7125KST  [LQFP48]
U4  SFH5110-36  [SFH511x]
U5  74LVC8T245  [TSSOP24]
U6  LM1117  [SOT223]
U7  74LVC8T245  [TSSOP24]
U8  NC7WZ16  [SC70]
U9  74LVC8T245  [TSSOP24]

### Blocks framed on the sheet
low-noise analog power supply: C27-C30 L3 U6

### Ports
BIAS (out, see 7), DISP1_DAT[0..23] (in, see 1), DISP1_HSYNC (in, see 1), DISP1_OE_ACD (in, see 1), DISP1_SCLK (in, see 1), DISP1_VSYNC (in, see 1), FCLK (out, see 7), GPIO2 (in, see 1), GPIO3 (in, see 1), GPIO11 (in, see 1), IR_RXD (out, see 2, 9), IR_TXD (in, see 9), LCLK (out, see 7), LDD[0..23] (out, see 7), PCLK (out, see 7), PLED (in, see 9), PSAVE (out, see 7), PWM (in, see 1), TSMX (see 3), TSMY (see 3), TSPX (see 3), TSPY (see 3), VGA_BLUE (out, see 7), VGA_GREEN (out, see 7), VGA_HSYNC (out, see 7), VGA_RED (out, see 7), VGA_VSYNC (out, see 7)

### Nets
3V3: R4.1 TP7.1
5V: C29.2 C30.2 C33.2 H5.33 H5.34 R9.1 R10.1 R16.1 R17.1 R18.1 U6.3(VIN) U8.5(VCC)
GND: C13.1 C14.2 C16.1 C22.1 C23.1 C24.1 C25.1 C26.1 C27.1 C28.1 C29.1 C30.1 C31.1 C32.1 C33.1 C34.1 C35.1 C36.1 C37.1 C38.1 C39.1 H5.1 H5.5 H5.12 H5.19 H5.26 H5.35 H5.36 L4.1 R19.2 T2.2(S) T3.2(S) T4.2(S) U1.5(SD) U1.8(GND) U2.11(GND) U2.12(GND) U2.13(GND) U2.22(~{OE}) U3.12(~{SYNC}) U4.2(GND) U5.11(GND) U5.12(GND) U5.13(GND) U5.22(~{OE}) U6.1(GND) U7.11(GND) U7.12(GND) U7.13(GND) U7.22(~{OE}) U8.2(GND) U9.11(GND) U9.12(GND) U9.13(GND) U9.22(~{OE})
VGND: C15.2 C19.1 C20.1 C21.1 L4.2 R7.1 R11.1 R12.1 R13.1 U3.1(GND) U3.2(GND) U3.14(GND) U3.15(GND) U3.25(GND) U3.26(GND) U3.27(~{IOB}) U3.31(~{IOG}) U3.33(~{IOR}) U3.39(GND) U3.40(GND)
VIO: C24.2 C32.2 C37.2 C39.2 U2.1(VCCA) U2.2(DIR) U5.1(VCCA) U5.2(DIR) U7.1(VCCA) U7.2(DIR) U9.1(VCCA) U9.2(DIR)
VLCD: C15.1 C16.2 C23.2 C31.2 C36.2 C38.2 H5.28 L1.1 L2.2 U2.23(VCCB) U2.24(VCCB) U5.23(VCCB) U5.24(VCCB) U7.23(VCCB) U7.24(VCCB) U9.23(VCCB) U9.24(VCCB)
VSB: C13.2 R5.2 R6.1 R8.1 T1.1(G)
VVGA: C17.2 C18.2 C19.2 C20.2 C21.2 L2.1 L3.1 U3.13(VAA) U3.29(VAA) U3.30(VAA)
BIAS: H5.27 RN7.5 U3.11(~{BLANK}) ; port BIAS
DISP1_DAT0: U2.3(A1)
DISP1_DAT1: U2.4(A2)
DISP1_DAT2: U2.5(A3)
DISP1_DAT3: U2.6(A4)
DISP1_DAT4: U2.7(A5)
DISP1_DAT5: U2.8(A6)
DISP1_DAT6: U2.9(A7)
DISP1_DAT7: U2.10(A8)
DISP1_DAT8: U5.3(A1)
DISP1_DAT9: U5.4(A2)
DISP1_DAT10: U5.5(A3)
DISP1_DAT11: U5.6(A4)
DISP1_DAT12: U5.7(A5)
DISP1_DAT13: U5.8(A6)
DISP1_DAT14: U5.9(A7)
DISP1_DAT15: U5.10(A8)
DISP1_DAT16: U7.3(A1)
DISP1_DAT17: U7.4(A2)
DISP1_DAT18: U7.5(A3)
DISP1_DAT19: U7.6(A4)
DISP1_DAT20: U7.7(A5)
DISP1_DAT21: U7.8(A6)
DISP1_DAT22: U7.9(A7)
DISP1_DAT23: U7.10(A8)
DISP1_HSYNC: U9.4(A2) ; port DISP1_HSYNC
DISP1_OE_ACD: U9.6(A4) ; port DISP1_OE_ACD
DISP1_SCLK: U9.5(A3) ; port DISP1_SCLK
DISP1_VSYNC: U9.3(A1) ; port DISP1_VSYNC
FCLK: H5.4 RN7.8 U8.3(A2) ; port FCLK
GPIO2: U9.8(A6) ; port GPIO2
GPIO3: U9.9(A7) ; port GPIO3
GPIO11: U9.10(A8) ; port GPIO11
IR_RXD: R8.2 T1.2(S) U1.4(RXD) ; port IR_RXD
IR_TXD: U1.3(TXD) ; port IR_TXD
LCLK: H5.3 RN7.7 U8.1(A1) ; port LCLK
LDD0: RN1.8 U3.16(B0)
LDD1: RN1.7 U3.17(B1)
LDD2: H5.20 RN1.6 U3.18(B2)
LDD3: H5.21 RN1.5 U3.19(B3)
LDD4: H5.22 RN2.8 U3.20(B4)
LDD5: H5.23 RN2.7 U3.21(B5)
LDD6: H5.24 RN2.6 U3.22(B6)
LDD7: H5.25 RN2.5 U3.23(B7)
LDD8: RN3.8 U3.3(G0)
LDD9: RN3.7 U3.4(G1)
LDD10: H5.13 RN3.6 U3.5(G2)
LDD11: H5.14 RN3.5 U3.6(G3)
LDD12: H5.15 RN4.8 U3.7(G4)
LDD13: H5.16 RN4.7 U3.8(G5)
LDD14: H5.17 RN4.6 U3.9(G6)
LDD15: H5.18 RN4.5 U3.10(G7)
LDD16: RN5.8 U3.41(R0)
LDD17: RN5.7 U3.42(R1)
LDD18: H5.6 RN5.6 U3.43(R2)
LDD19: H5.7 RN5.5 U3.44(R3)
LDD20: H5.8 RN6.8 U3.45(R4)
LDD21: H5.9 RN6.7 U3.46(R5)
LDD22: H5.10 RN6.6 U3.47(R6)
LDD23: H5.11 RN6.5 U3.48(R7)
LGPIO0: H5.31 RN8.7 T2.1(G)
LGPIO1: H5.30 RN8.6 T3.1(G)
LPWM: H5.32 RN8.8
P11: C14.1 L1.2 R4.2 TP8.1
PCLK: H5.2 RN7.6 U3.24(CLOCK) ; port PCLK
PLED: R19.1 T4.1(G) ; port PLED
PSAVE: H5.29 RN8.5 U3.38(~{PSAVE}) ; port PSAVE
PWM: U9.7(A5) ; port PWM
TSMX: H5.37 ; port TSMX
TSMY: H5.38 ; port TSMY
TSPX: H5.39 ; port TSPX
TSPY: H5.40 ; port TSPY
VGA_BLUE: R13.2 U3.28(IOB) ; port VGA_BLUE
VGA_GREEN: R12.2 U3.32(IOG) ; port VGA_GREEN
VGA_HSYNC: C34.2 L5.2 ; port VGA_HSYNC
VGA_RED: R11.2 U3.34(IOR) ; port VGA_RED
VGA_VSYNC: C35.2 L6.2 ; port VGA_VSYNC
NetC17_1: C17.1 U3.36(VREF)
NetC18_1: C18.1 U3.35(COMP)
NetC22_2: C22.2 R6.2 U1.6(VCC1)
NetC25_2: C25.2 C26.2 R10.2 U4.3(VCC)
NetC27_2: C27.2 C28.2 L3.2 U6.2(VOUT)
NetL5_1: L5.1 R14.1
NetL6_1: L6.1 R15.1
NetLH1_1: LH1.1 T4.3(D)
NetLH1_2: LH1.2 R16.2
NetLH1_3: LH1.3 T3.3(D)
NetLH1_4: LH1.4 R17.2
NetLH1_5: LH1.5 T2.3(D)
NetLH1_6: LH1.6 R18.2
NetR5_1: R5.1 U1.1(VCC2)
NetR7_2: R7.2 U3.37(RSET)
NetR9_2: R9.2 T1.3(D) U4.1(OUT)
NetR14_2: R14.2 U8.6(Y1)
NetR15_2: R15.2 U8.4(Y2)
NetRN1_1: RN1.1 U2.21(B1)
NetRN1_2: RN1.2 U2.20(B2)
NetRN1_3: RN1.3 U2.19(B3)
NetRN1_4: RN1.4 U2.18(B4)
NetRN2_1: RN2.1 U2.17(B5)
NetRN2_2: RN2.2 U2.16(B6)
NetRN2_3: RN2.3 U2.15(B7)
NetRN2_4: RN2.4 U2.14(B8)
NetRN3_1: RN3.1 U5.21(B1)
NetRN3_2: RN3.2 U5.20(B2)
NetRN3_3: RN3.3 U5.19(B3)
NetRN3_4: RN3.4 U5.18(B4)
NetRN4_1: RN4.1 U5.17(B5)
NetRN4_2: RN4.2 U5.16(B6)
NetRN4_3: RN4.3 U5.15(B7)
NetRN4_4: RN4.4 U5.14(B8)
NetRN5_1: RN5.1 U7.21(B1)
NetRN5_2: RN5.2 U7.20(B2)
NetRN5_3: RN5.3 U7.19(B3)
NetRN5_4: RN5.4 U7.18(B4)
NetRN6_1: RN6.1 U7.17(B5)
NetRN6_2: RN6.2 U7.16(B6)
NetRN6_3: RN6.3 U7.15(B7)
NetRN6_4: RN6.4 U7.14(B8)
NetRN7_1: RN7.1 U9.21(B1)
NetRN7_2: RN7.2 U9.20(B2)
NetRN7_3: RN7.3 U9.19(B3)
NetRN7_4: RN7.4 U9.18(B4)
NetRN8_1: RN8.1 U9.17(B5)
NetRN8_2: RN8.2 U9.16(B6)
NetRN8_3: RN8.3 U9.15(B7)
NetRN8_4: RN8.4 U9.14(B8)

Not connected (* = marked no-connect by the designer): U1 2(IREDC)* 7(NC)*

### Buses and harness runs
bus DISP1_DAT[0..23] = port DISP1_DAT[0..23]
bus LDD[0..23] = port LDD[0..23]

### Notes on the sheet
- 1 [mA] = 10 * U [mV]
- LCD, VGA
- INFRA RED
- LCD BUFFERS
- VGA
- (near H5) LCD
- LEDS
- (in symbol LEDH3) GREEN; YELLOW; RED

### Library data of the parts
C13 C16-C39 = C
C14 C15 = C+
L1-L6 = FBEAD
R4-R19 = R
RN1-RN8 = RN4
TP7 TP8 = TESTPOINT: as TP1 on sheet [03] - DIMM CON; Component class: TP; Producer: n/a; Assembly type: no component
U2 = SN74LVC8T245DBQR: IC BUS TRANSCVR 8BIT 24QSOP; Manufacturer: Texas Instruments; Logic Function: Translator, Bidirectional, 3-State; Number of Bits: 8; Input Type: Logic; Number of Channels: 1; Differential - Input:Output: No/No; Propagation Delay (Max): 4.2ns; Voltage - Supply: 1.65 V ~ 5.5 V; Supplier 1: Digi-Key; Manufacturer Part Number: SN74LVC8T245DBQR; RoHS: RoHS Compliant; Category: Integrated Circuits (ICs); Stock 1: 4942; Pricing 1: 1=1.26, 10=1.117, 25=1.008, 100=0.4725, 250=0.46376, 500=0.455, 750=0.44625 (USD); Output Type: Logic; Data Rate: -; Number of Outputs/Channel: 8; Operating Temperature: -40°C ~ 85°C; Package / Case: 24-SSOP (0.154", 3.90mm Width); Supplier Device Package: 24-SSOP/QSOP; Packaging: Cut Tape (CT); ComponentLink1URL: http://www.ti.com/lit/ds/symlink/sn74lvc8t245.pdf; ComponentLink1Description: http://www.ti.com/lit/ds/symlink/sn74lvc8t245.pdf; Supplier Part Number 1: 296-23279-1-ND
U3 = ADV7125
U4 = SFH5110

## Sheet [05] - AUDIO.SchDoc: IMXBB
size A3; DocumentNumber: 5; Revision: 2.0; SheetNumber: 5; SheetTotal: 13
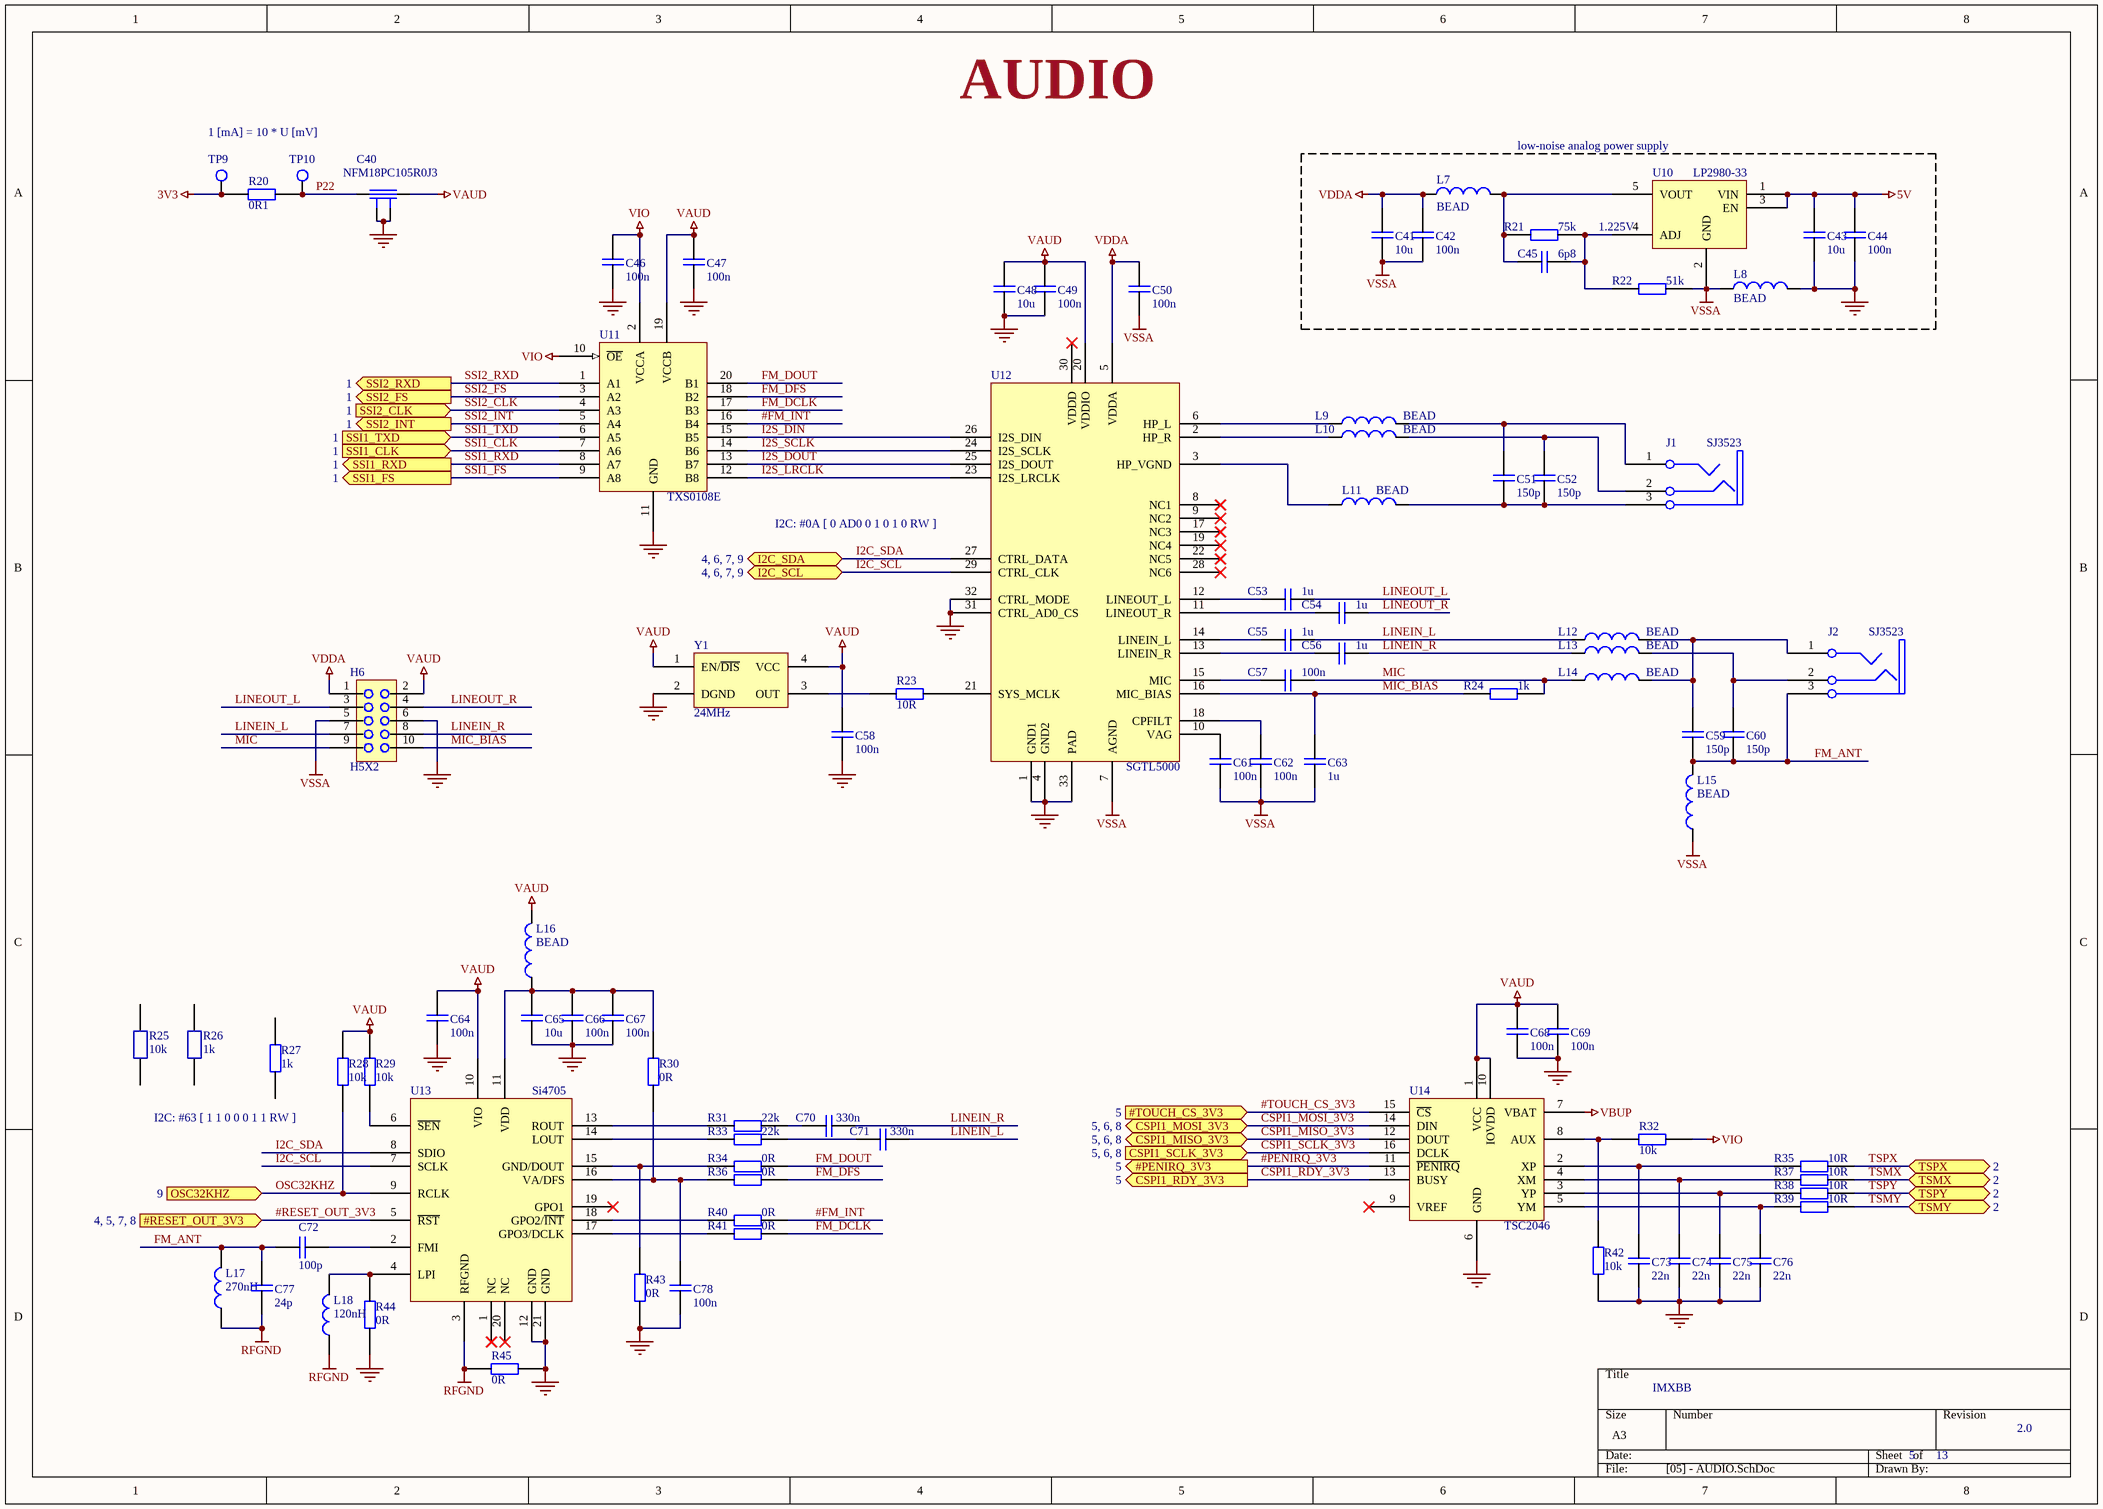
[diagram p5: [05] - AUDIO.SchDoc]

### Parts
C40  NFM18PC105R0J3  [NFM18P]
C41  10u  [0805]
C42  100n  [0603]
C43  10u  [0805]
C44  100n  [0603]
C45  6p8  [0603]
C46  100n  [0603]
C47  100n  [0603]
C48  10u  [0805]
C49  100n  [0603]
C50  100n  [0603]
C51  150p  [0603]
C52  150p  [0603]
C53  1u  [0603]
C54  1u  [0603]
C55  1u  [0603]
C56  1u  [0603]
C57  100n  [0603]
C58  100n  [0603]
C59  150p  [0603]
C60  150p  [0603]
C61  100n  [0603]
C62  100n  [0603]
C63  1u  [0603]
C64  100n  [0603]
C65  10u  [0805]
C66  100n  [0603]
C67  100n  [0603]
C68  100n  [0603]
C69  100n  [0603]
C70  330n  [0603]
C71  330n  [0603]
C72  100p  [0603]
C73  22n  [0603]
C74  22n  [0603]
C75  22n  [0603]
C76  22n  [0603]
C77  24p  [0603]
C78  100n  [0603]
H6  H5X2  [H2x5]
J1  SJ3523  [SJ35_NS]
J2  SJ3523  [SJ35_NS]
L7  BEAD  [0603]
L8  BEAD  [0603]
L9  BEAD  [0603]
L10  BEAD  [0603]
L11  BEAD  [0603]
L12  BEAD  [0603]
L13  BEAD  [0603]
L14  BEAD  [0603]
L15  BEAD  [0603]
L16  BEAD  [0603]
L17  270nH  [0603]
L18  120nH  [0603]
R20  0R1  [0603]
R21  75k  [0603]
R22  51k  [0603]
R23  10R  [0603]
R24  1k  [0603]
R25  10k
R26  1k
R27  1k  [0603]
R28  10k  [0603]
R29  10k  [0603]
R30  0R  [0603]
R31  22k  [0603]
R32  10k  [0603]
R33  22k  [0603]
R34  0R  [0603]
R35  10R  [0603]
R36  0R  [0603]
R37  10R  [0603]
R38  10R  [0603]
R39  10R  [0603]
R40  0R  [0603]
R41  0R  [0603]
R42  10k  [0603]
R43  0R  [0603]
R44  0R  [0603]
R45  0R  [0603]
TP9  TESTPOINT  [TESTPOINT_2mm]  (value not drawn)
TP10  TESTPOINT  [TESTPOINT_2mm]  (value not drawn)
U10  LP2980-33  [SOT23-5]
U11  TXS0108E  [TSSOP20]
U12  SGTL5000  [QFN32]
U13  Si4705  [QFN20]
U14  TSC2046  [TSSOP16]
Y1  24MHz  [JO75]

### Ports
#PENIRQ_3V3 (out, see 5), #RESET_OUT_3V3 (in, see 4, 5, 7, 8), #TOUCH_CS_3V3 (in, see 5), CSPI1_MISO_3V3 (bidir, see 5, 6, 8), CSPI1_MOSI_3V3 (bidir, see 5, 6, 8), CSPI1_RDY_3V3 (out, see 5), CSPI1_SCLK_3V3 (in, see 5, 6, 8), I2C_SCL (bidir, see 4, 6, 7, 9), I2C_SDA (bidir, see 4, 6, 7, 9), OSC32KHZ (in, see 9), SSI1_CLK (in, see 1), SSI1_FS (out, see 1), SSI1_RXD (out, see 1), SSI1_TXD (in, see 1), SSI2_CLK (in, see 1), SSI2_FS (out, see 1), SSI2_INT (out, see 1), SSI2_RXD (out, see 1), TSMX (see 2), TSMY (see 2), TSPX (see 2), TSPY (see 2)

### Nets
3V3: R20.1 TP9.1
5V: C43.2 C44.2 U10.1(VIN) U10.3(EN)
GND: C40.2 C40.4 C43.1 C44.1 C46.1 C47.1 C48.1 C49.1 C58.1 C64.1 C65.1 C66.1 C67.1 C68.1 C69.1 C73.1 C74.1 C75.1 C76.1 C78.1 H6.6 L8.1 R42.1 R43.1 R44.1 R45.1 U11.11(GND) U12.1(GND1) U12.4(GND2) U12.31(CTRL_AD0_CS) U12.32(CTRL_MODE) U12.33(PAD) U13.12(GND) U13.21(GND) U14.6(GND) Y1.2(DGND)
RFGND: C77.2 L17.1 L18.1 R45.2 U13.3(RFGND)
VAUD: C40.3 C47.2 C48.2 C49.2 C58.2 C64.2 C68.2 C69.2 H6.2 L16.2 R28.2 R29.2 U11.19(VCCB) U12.20(VDDIO) U13.10(VIO) U14.1(VCC) U14.10(IOVDD) Y1.1(EN/~{DIS}) Y1.4(VCC)
VBUP: U14.7(VBAT)
VDDA: C41.2 C42.2 C50.2 H6.1 L7.1 U12.5(VDDA)
VIO: C46.2 R32.1 U11.2(VCCA) U11.10(~{OE})
VSSA: C41.1 C42.1 C50.1 C61.1 C62.1 C63.2 H6.5 L8.2 L15.1 R22.1 U10.2(GND) U12.7(AGND)
#FM_INT: R40.1 U11.16(B4)
#PENIRQ_3V3: U14.11(~{PENIRQ}) ; port #PENIRQ_3V3
#RESET_OUT_3V3: U13.5(~{RST}) ; port #RESET_OUT_3V3
#TOUCH_CS_3V3: U14.15(~{CS}) ; port #TOUCH_CS_3V3
CSPI1_MISO_3V3: U14.12(DOUT) ; port CSPI1_MISO_3V3
CSPI1_MOSI_3V3: U14.14(DIN) ; port CSPI1_MOSI_3V3
CSPI1_RDY_3V3: U14.13(BUSY) ; port CSPI1_RDY_3V3
CSPI1_SCLK_3V3: U14.16(DCLK) ; port CSPI1_SCLK_3V3
FM_ANT: C59.1 C60.1 C72.2 C77.1 J2.3 L15.2 L17.2
FM_DCLK: R41.1 U11.17(B3)
FM_DFS: R36.1 U11.18(B2)
FM_DOUT: R34.1 U11.20(B1)
I2C_SCL: U12.29(CTRL_CLK) U13.7(SCLK) ; port I2C_SCL
I2C_SDA: U12.27(CTRL_DATA) U13.8(SDIO) ; port I2C_SDA
I2S_DIN: U11.15(B5) U12.26(I2S_DIN)
I2S_DOUT: U11.13(B7) U12.25(I2S_DOUT)
I2S_LRCLK: U11.12(B8) U12.23(I2S_LRCLK)
I2S_SCLK: U11.14(B6) U12.24(I2S_SCLK)
LINEIN_L: C55.1 C71.1 H6.7 L12.1
LINEIN_R: C56.1 C70.1 H6.8 L13.1
LINEOUT_L: C53.1 H6.3
LINEOUT_R: C54.1 H6.4
MIC: C57.1 H6.9 L14.1 R24.1
MIC_BIAS: C63.1 H6.10 R24.2 U12.16(MIC_BIAS)
OSC32KHZ: R28.1 U13.9(RCLK) ; port OSC32KHZ
P22: C40.1 R20.2 TP10.1
SSI1_CLK: U11.7(A6) ; port SSI1_CLK
SSI1_FS: U11.9(A8) ; port SSI1_FS
SSI1_RXD: U11.8(A7) ; port SSI1_RXD
SSI1_TXD: U11.6(A5) ; port SSI1_TXD
SSI2_CLK: U11.4(A3) ; port SSI2_CLK
SSI2_FS: U11.3(A2) ; port SSI2_FS
SSI2_INT: U11.5(A4) ; port SSI2_INT
SSI2_RXD: U11.1(A1) ; port SSI2_RXD
TSMX: R37.2 ; port TSMX
TSMY: R39.2 ; port TSMY
TSPX: R35.2 ; port TSPX
TSPY: R38.2 ; port TSPY
NetC45_1: C45.1 R21.1 R22.2 U10.4(ADJ)
NetC45_2: C45.2 L7.2 R21.2 U10.5(VOUT)
NetC51_1: C51.1 C52.1 J1.3 L11.2
NetC51_2: C51.2 J1.1 L9.2
NetC52_2: C52.2 J1.2 L10.2
NetC53_2: C53.2 U12.12(LINEOUT_L)
NetC54_2: C54.2 U12.11(LINEOUT_R)
NetC55_2: C55.2 U12.14(LINEIN_L)
NetC56_2: C56.2 U12.13(LINEIN_R)
NetC57_2: C57.2 U12.15(MIC)
NetC59_2: C59.2 J2.1 L12.2 L14.2
NetC60_2: C60.2 J2.2 L13.2
NetC61_2: C61.2 U12.10(VAG)
NetC62_2: C62.2 U12.18(CPFILT)
NetC65_2: C65.2 C66.2 C67.2 L16.1 R30.2 U13.11(VDD)
NetC70_2: C70.2 R31.1
NetC71_2: C71.2 R33.1
NetC72_1: C72.1 U13.2(FMI)
NetC73_2: C73.2 R35.1 U14.2(XP)
NetC74_2: C74.2 R37.1 U14.4(XM)
NetC75_2: C75.2 R38.1 U14.3(YP)
NetC76_2: C76.2 R39.1 U14.5(YM)
NetC78_2: C78.2 R30.1 R36.2 U13.16(VA/DFS)
NetL9_1: L9.1 U12.6(HP_L)
NetL10_1: L10.1 U12.2(HP_R)
NetL11_1: L11.1 U12.3(HP_VGND)
NetL18_2: L18.2 R44.2 U13.4(LPI)
NetR23_1: R23.1 Y1.3(OUT)
NetR23_2: R23.2 U12.21(SYS_MCLK)
NetR29_1: R29.1 U13.6(~{SEN})
NetR31_2: R31.2 U13.13(ROUT)
NetR32_2: R32.2 R42.2 U14.8(AUX)
NetR33_2: R33.2 U13.14(LOUT)
NetR34_2: R34.2 R43.2 U13.15(GND/DOUT)
NetR40_2: R40.2 U13.18(GPO2/~{INT})
NetR41_2: R41.2 U13.17(GPO3/DCLK)

Not connected (* = marked no-connect by the designer): R25 1 2; R26 1 2; R27 1 2; U12 8(NC1)* 9(NC2)* 17(NC3)* 19(NC4)* 22(NC5)* 28(NC6)* 30(VDDD)*; U13 1(NC)* 19(GPO1)* 20(NC)*; U14 9(VREF)*

### Notes on the sheet
- AUDIO
- 1 [mA] = 10 * U [mV]
- low-noise analog power supply
- (near U10) 1.225V
- (near U12) I2C: #0A [ 0 AD0 0 1 0 1 0 RW ]
- I2C: #63 [ 1 1 0 0 0 1 1 RW ]

### Library data of the parts
C40 = NFL21S: Chip EMIFIL; Producer: Murata; Order number: NFM18PC105R0J3; Component class: C; Assembly type: SMT
C41-C78 = C
L7-L16 = FBEAD
L17 L18 = L
R20-R24 R27-R45 = R
R25 = ERJ-3EKF1002V: RES 10.0K OHM 1/10W 1% 0603 SMD; Manufacturer: Panasonic Electronic Components; Power (Watts): 0.1W, 1/10W; Temperature Coefficient: ±100ppm/°C; Supplier 1: Digi-Key; Manufacturer Part Number: ERJ-3EKF1002V; RoHS: RoHS Compliant; Category: Resistors; Stock 1: 6966498; Pricing 1: 1=0.1, 50=0.0138, 100=0.0105, 250=0.0078, 500=0.00576, 1000=0.00384 (USD); Resistance (Ohms): 10k; Composition: Thick Film; Features: -; Tolerance: ±1%; Package / Case: 0603 (1608 Metric); Supplier Device Package: 0603; Size / Dimension: 0.063" L x 0.031" W (1.60mm x 0.80mm); Height: 0.022" (0.55mm); Number of Terminations: 2; Packaging: Cut Tape (CT); ComponentLink1URL: http://industrial.panasonic.com/www-cgi/jvcr13pz.cgi?E+PZ+3+AOA0002+ERJ3EKF1002V+7+WW; ComponentLink1Description: http://industrial.panasonic.com/www-cgi/jvcr13pz.cgi?E+PZ+3+AOA0002+ERJ3EKF1002V+7+WW; Supplier Part Number 1: P10.0KHCT-ND
R26 = ERJ-3EKF1001V: RES 1.00K OHM 1/10W 1% 0603 SMD; Manufacturer: Panasonic Electronic Components; Power (Watts): 0.1W, 1/10W; Temperature Coefficient: ±100ppm/°C; Supplier 1: Digi-Key; Manufacturer Part Number: ERJ-3EKF1001V; RoHS: RoHS Compliant; Category: Resistors; Stock 1: 7244544; Pricing 1: 1=0.1, 50=0.0138, 100=0.0105, 250=0.0078, 500=0.00576, 1000=0.00384 (USD); Resistance (Ohms): 1k; Composition: Thick Film; Features: -; Tolerance: ±1%; Package / Case: 0603 (1608 Metric); Supplier Device Package: 0603; Size / Dimension: 0.063" L x 0.031" W (1.60mm x 0.80mm); Height: 0.022" (0.55mm); Number of Terminations: 2; Packaging: Cut Tape (CT); ComponentLink1URL: http://industrial.panasonic.com/www-cgi/jvcr13pz.cgi?E+PZ+3+AOA0002+ERJ3EKF1001V+7+WW; ComponentLink1Description: http://industrial.panasonic.com/www-cgi/jvcr13pz.cgi?E+PZ+3+AOA0002+ERJ3EKF1001V+7+WW; Supplier Part Number 1: P1.00KHCT-ND
TP9 TP10 = TESTPOINT: as TP1 on sheet [03] - DIMM CON; Component class: TP; Producer: n/a; Assembly type: no component
U10 = LP2980
U13 = Si470x
Y1 = OSC

## Sheet [06] - USB.SchDoc: IMXBB
size A3; DocumentNumber: 6; Revision: 2.0; SheetNumber: 6; SheetTotal: 13
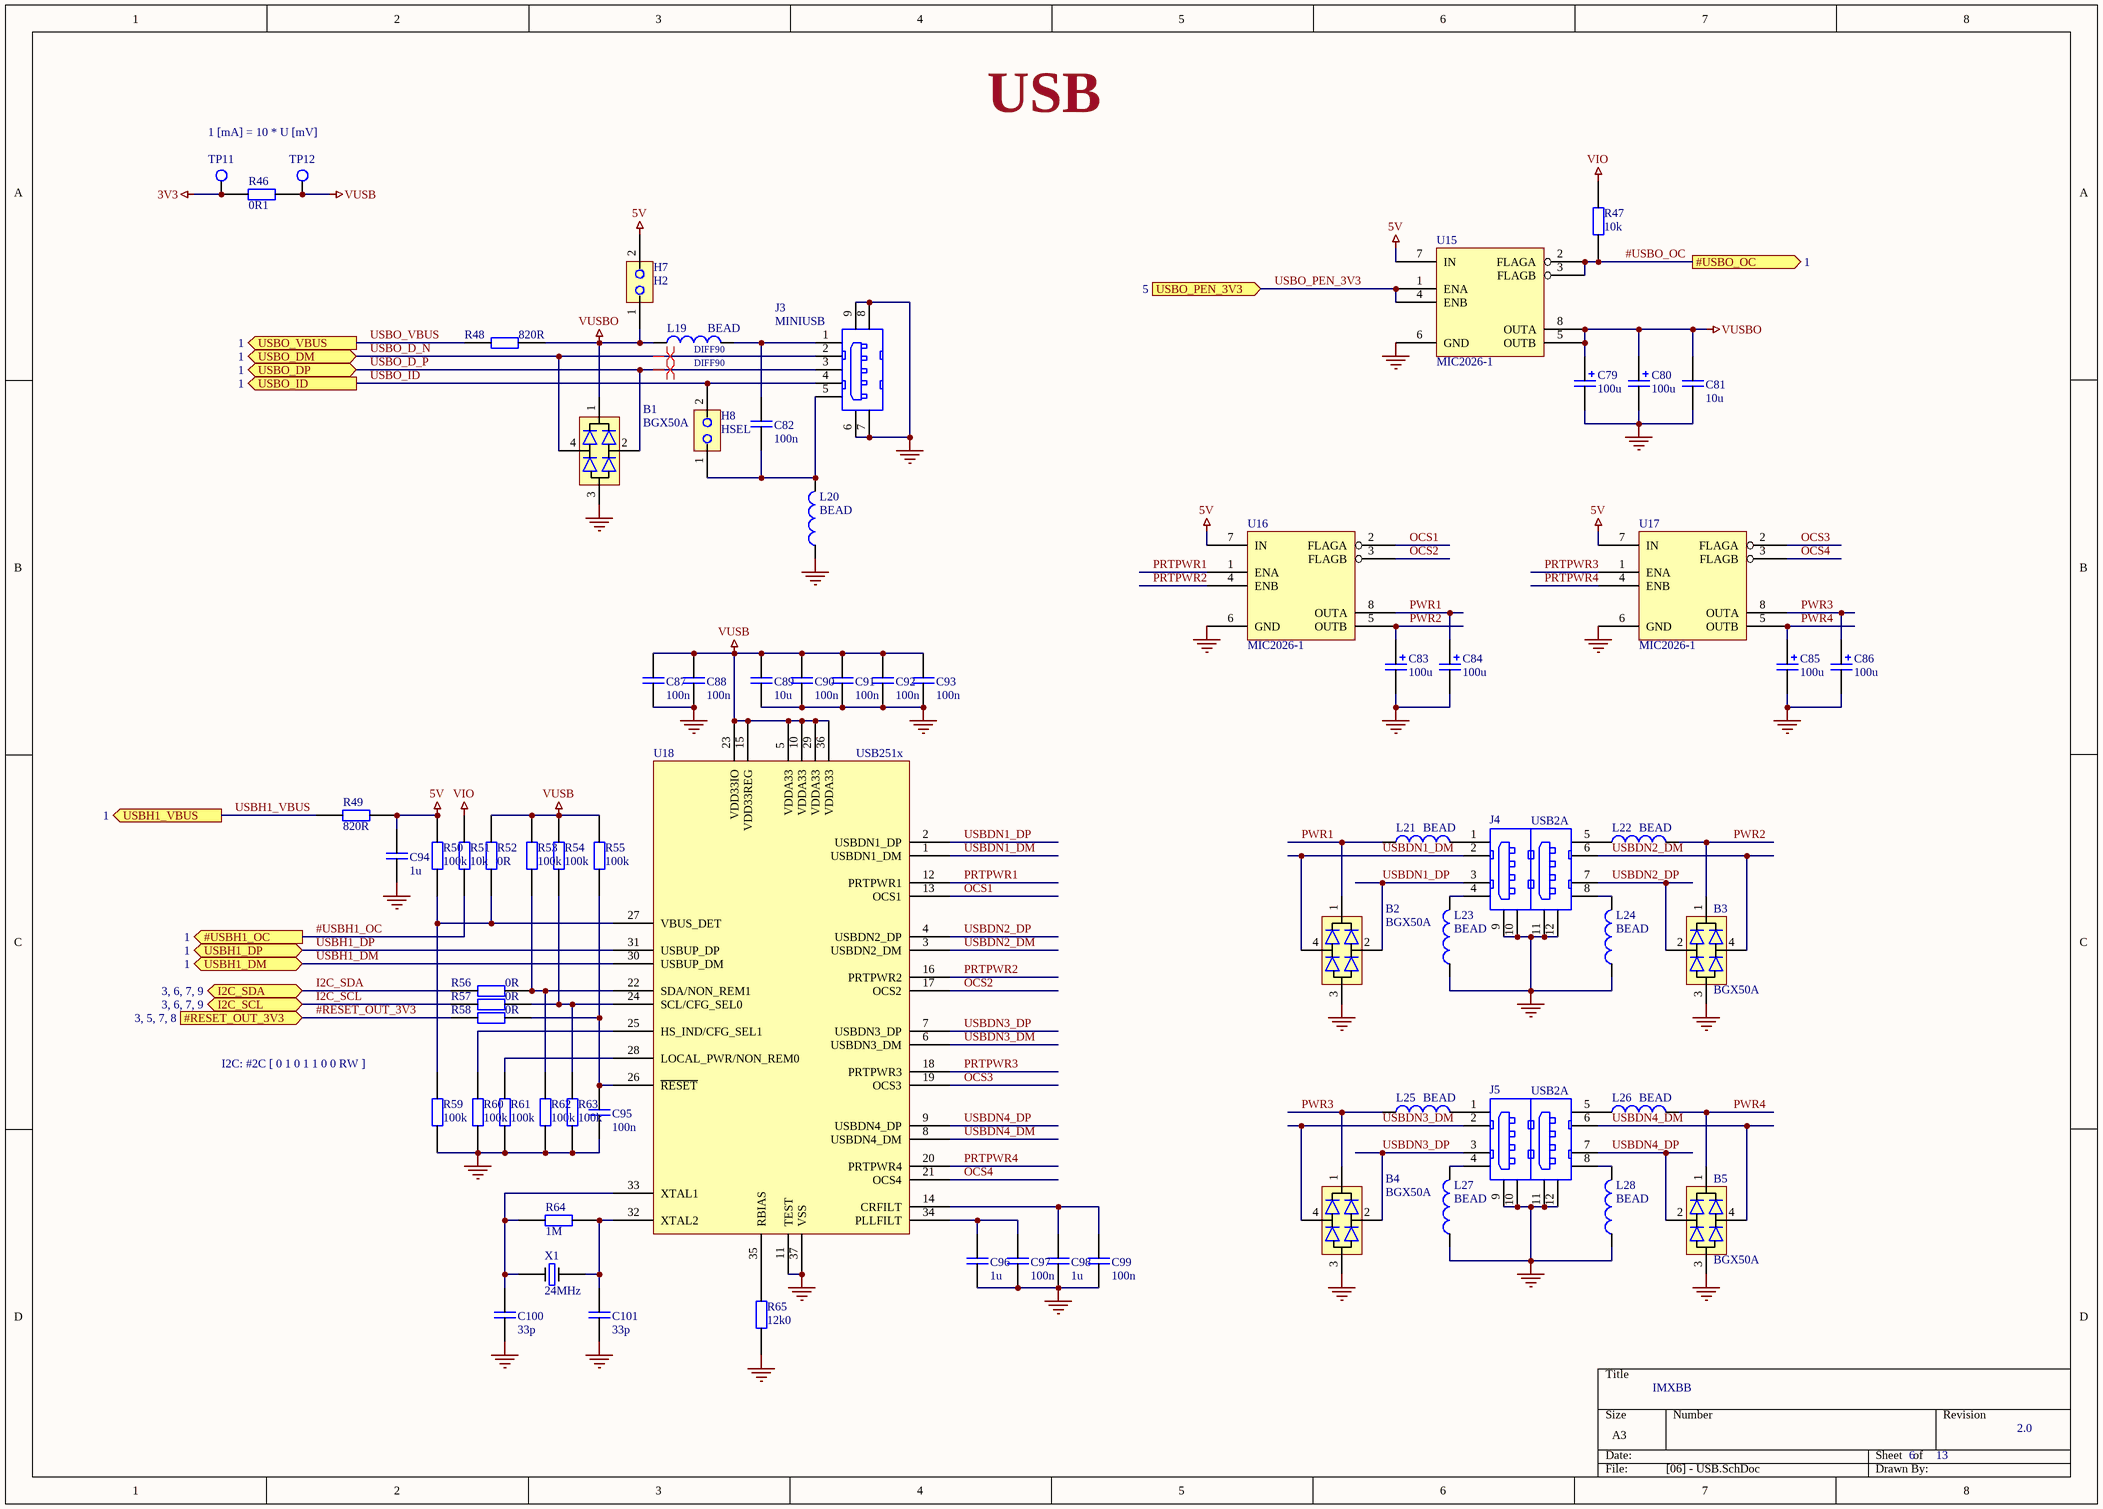
[diagram p6: [06] - USB.SchDoc]

### Parts
B1  BGX50A  [SOT143]
B2  BGX50A  [SOT143]
B3  BGX50A  [SOT143]
B4  BGX50A  [SOT143]
B5  BGX50A  [SOT143]
C79  100u  [CTANTALD]
C80  100u  [CTANTALD]
C81  10u  [0805]
C82  100n  [0603]
C83  100u  [CTANTALD]
C84  100u  [CTANTALD]
C85  100u  [CTANTALD]
C86  100u  [CTANTALD]
C87  100n  [0603]
C88  100n  [0603]
C89  10u  [0805]
C90  100n  [0603]
C91  100n  [0603]
C92  100n  [0603]
C93  100n  [0603]
C94  1u  [0603]
C95  100n  [0603]
C96  1u  [0603]
C97  100n  [0603]
C98  1u  [0603]
C99  100n  [0603]
C100  33p  [0603]
C101  33p  [0603]
H7  H2  [H1x2]
H8  HSEL  [H1x2]
J3  MINIUSB  [MINI_USB_AB]
J4  USB2A  [USB-2A]
J5  USB2A  [USB-2A]
L19  BEAD  [0603]
L20  BEAD  [0603]
L21  BEAD  [0603]
L22  BEAD  [0603]
L23  BEAD  [0603]
L24  BEAD  [0603]
L25  BEAD  [0603]
L26  BEAD  [0603]
L27  BEAD  [0603]
L28  BEAD  [0603]
R46  0R1  [0603]
R47  10k  [0603]
R48  820R  [0603]
R49  820R  [0603]
R50  100k  [0603]
R51  10k  [0603]
R52  0R  [0603]
R53  100k  [0603]
R54  100k  [0603]
R55  100k  [0603]
R56  0R  [0603]
R57  0R  [0603]
R58  0R  [0603]
R59  100k  [0603]
R60  100k  [0603]
R61  100k  [0603]
R62  100k  [0603]
R63  100k  [0603]
R64  1M  [0603]
R65  12k0  [0603]
TP11  TESTPOINT  [TESTPOINT_2mm]  (value not drawn)
TP12  TESTPOINT  [TESTPOINT_2mm]  (value not drawn)
U15  MIC2026-1  [SOIC8N]
U16  MIC2026-1  [SOIC8N]
U17  MIC2026-1  [SOIC8N]
U18  USB251x  [QFN36]
X1  24MHz  [HC494H]

### Ports
#RESET_OUT_3V3 (in, see 3, 5, 7, 8), #USBH1_OC (out, see 1), #USBO_OC (out, see 1), I2C_SCL (bidir, see 3, 6, 7, 9), I2C_SDA (bidir, see 3, 6, 7, 9), USBH1_DM (bidir, see 1), USBH1_DP (bidir, see 1), USBH1_VBUS (out, see 1), USBO_DM (bidir, see 1), USBO_DP (bidir, see 1), USBO_ID (out, see 1), USBO_PEN_3V3 (in, see 5), USBO_VBUS (out, see 1)

### Nets
3V3: R46.1 TP11.1
5V: C94.2 H7.2 R49.1 R50.2 U15.7(IN) U16.7(IN) U17.7(IN)
GND: B1.3 B2.3 B3.3 B4.3 B5.3 C79.2 C80.2 C81.1 C83.2 C84.2 C85.2 C86.2 C87.1 C88.1 C89.1 C90.1 C91.1 C92.1 C93.1 C94.1 C95.1 C96.1 C97.1 C98.1 C99.1 C100.1 C101.1 J3.6(SHIELD) J3.7(SHIELD) J3.8(SHIELD) J3.9(SHIELD) J4.9(SHIELD) J4.10(SHIELD) J4.11(SHIELD) J4.12(SHIELD) J5.9(SHIELD) J5.10(SHIELD) J5.11(SHIELD) J5.12(SHIELD) L20.1 L23.1 L24.1 L27.1 L28.1 R59.2 R60.2 R61.2 R62.2 R63.2 R65.1 U15.6(GND) U16.6(GND) U17.6(GND) U18.11(TEST) U18.37(VSS)
VIO: R47.1 R51.1
VUSB: C87.2 C88.2 C89.2 C90.2 C91.2 C92.2 C93.2 R46.2 R52.2 R53.1 R54.1 R55.1 TP12.1 U18.5(VDDA33) U18.10(VDDA33) U18.15(VDD33REG) U18.23(VDD33IO) U18.29(VDDA33) U18.36(VDDA33)
VUSBO: B1.1 C79.1 C80.1 C81.2 H7.1 L19.1 R48.1 U15.5(OUTB) U15.8(OUTA)
#RESET_OUT_3V3: R58.2 ; port #RESET_OUT_3V3
#USBH1_OC: R51.2 ; port #USBH1_OC
#USBO_OC: R47.2 U15.2(FLAGA) U15.3(FLAGB) ; port #USBO_OC
I2C_SCL: R57.2 ; port I2C_SCL
I2C_SDA: R56.2 ; port I2C_SDA
OCS1: U16.2(FLAGA) U18.13(OCS1)
OCS2: U16.3(FLAGB) U18.17(OCS2)
OCS3: U17.2(FLAGA) U18.19(OCS3)
OCS4: U17.3(FLAGB) U18.21(OCS4)
PRTPWR1: U16.1(ENA) U18.12(PRTPWR1)
PRTPWR2: U16.4(ENB) U18.16(PRTPWR2)
PRTPWR3: U17.1(ENA) U18.18(PRTPWR3)
PRTPWR4: U17.4(ENB) U18.20(PRTPWR4)
PWR1: B2.1 C84.1 L21.1 U16.8(OUTA)
PWR2: B3.1 C83.1 L22.2 U16.5(OUTB)
PWR3: B4.1 C86.1 L25.1 U17.8(OUTA)
PWR4: B5.1 C85.1 L26.2 U17.5(OUTB)
USBDN1_DM: B2.4 J4.2(D-) U18.1(USBDN1_DM)
USBDN1_DP: B2.2 J4.3(D+) U18.2(USBDN1_DP)
USBDN2_DM: B3.4 J4.6(D2-) U18.3(USBDN2_DM)
USBDN2_DP: B3.2 J4.7(D2+) U18.4(USBDN2_DP)
USBDN3_DM: B4.4 J5.2(D-) U18.6(USBDN3_DM)
USBDN3_DP: B4.2 J5.3(D+) U18.7(USBDN3_DP)
USBDN4_DM: B5.4 J5.6(D2-) U18.8(USBDN4_DM)
USBDN4_DP: B5.2 J5.7(D2+) U18.9(USBDN4_DP)
USBH1_DM: U18.30(USBUP_DM) ; port USBH1_DM
USBH1_DP: U18.31(USBUP_DP) ; port USBH1_DP
USBH1_VBUS: R49.2 ; port USBH1_VBUS
USBO_D_N: B1.4 J3.2(D-) ; port USBO_DM
USBO_D_P: B1.2 J3.3(D+) ; port USBO_DP
USBO_ID: H8.2 J3.4(ID) ; port USBO_ID
USBO_PEN_3V3: U15.1(ENA) U15.4(ENB) ; port USBO_PEN_3V3
USBO_VBUS: R48.2 ; port USBO_VBUS
NetC82_1: C82.1 H8.1 J3.5(GND) L20.2
NetC82_2: C82.2 J3.1(VBUS) L19.2
NetC95_2: C95.2 R55.2 R58.1 U18.26(~{RESET})
NetC96_2: C96.2 C97.2 U18.34(PLLFILT)
NetC98_2: C98.2 C99.2 U18.14(CRFILT)
NetC100_2: C100.2 R64.2 U18.33(XTAL1) X1.1
NetC101_2: C101.2 R64.1 U18.32(XTAL2) X1.2
NetJ4_1: J4.1(VBUS) L21.2
NetJ4_4: J4.4(GND) L23.2
NetJ4_5: J4.5(VBUS2) L22.1
NetJ4_8: J4.8(GND) L24.2
NetJ5_1: J5.1(VBUS) L25.2
NetJ5_4: J5.4(GND) L27.2
NetJ5_5: J5.5(VBUS2) L26.1
NetJ5_8: J5.8(GND) L28.2
NetR50_1: R50.1 R52.1 R59.1 U18.27(VBUS_DET)
NetR53_2: R53.2 R56.1 R62.1 U18.22(SDA/NON_REM1)
NetR54_2: R54.2 R57.1 R63.1 U18.24(SCL/CFG_SEL0)
NetR60_1: R60.1 U18.25(HS_IND/CFG_SEL1)
NetR61_1: R61.1 U18.28(LOCAL_PWR/NON_REM0)
NetR65_2: R65.2 U18.35(RBIAS)

### Layout directives
differential pair; net class DIFF90: USBO_D_N, USBO_D_P

### Notes on the sheet
- 1 [mA] = 10 * U [mV]
- USB
- (near R59) I2C: #2C [ 0 1 0 1 1 0 0 RW ]

### Library data of the parts
C79 C80 C83-C86 = C+
C81 C82 C87-C101 = C
H8 = H2
L19-L28 = FBEAD
R46-R65 = R
TP11 TP12 = TESTPOINT: as TP1 on sheet [03] - DIMM CON; Component class: TP; Producer: n/a; Assembly type: no component
U15-U17 = MIC2026
X1 = XTAL

## Sheet [07] - RS232.SchDoc: IMXBB
size A3; DocumentNumber: 7; Revision: 2.0; SheetNumber: 7; SheetTotal: 13
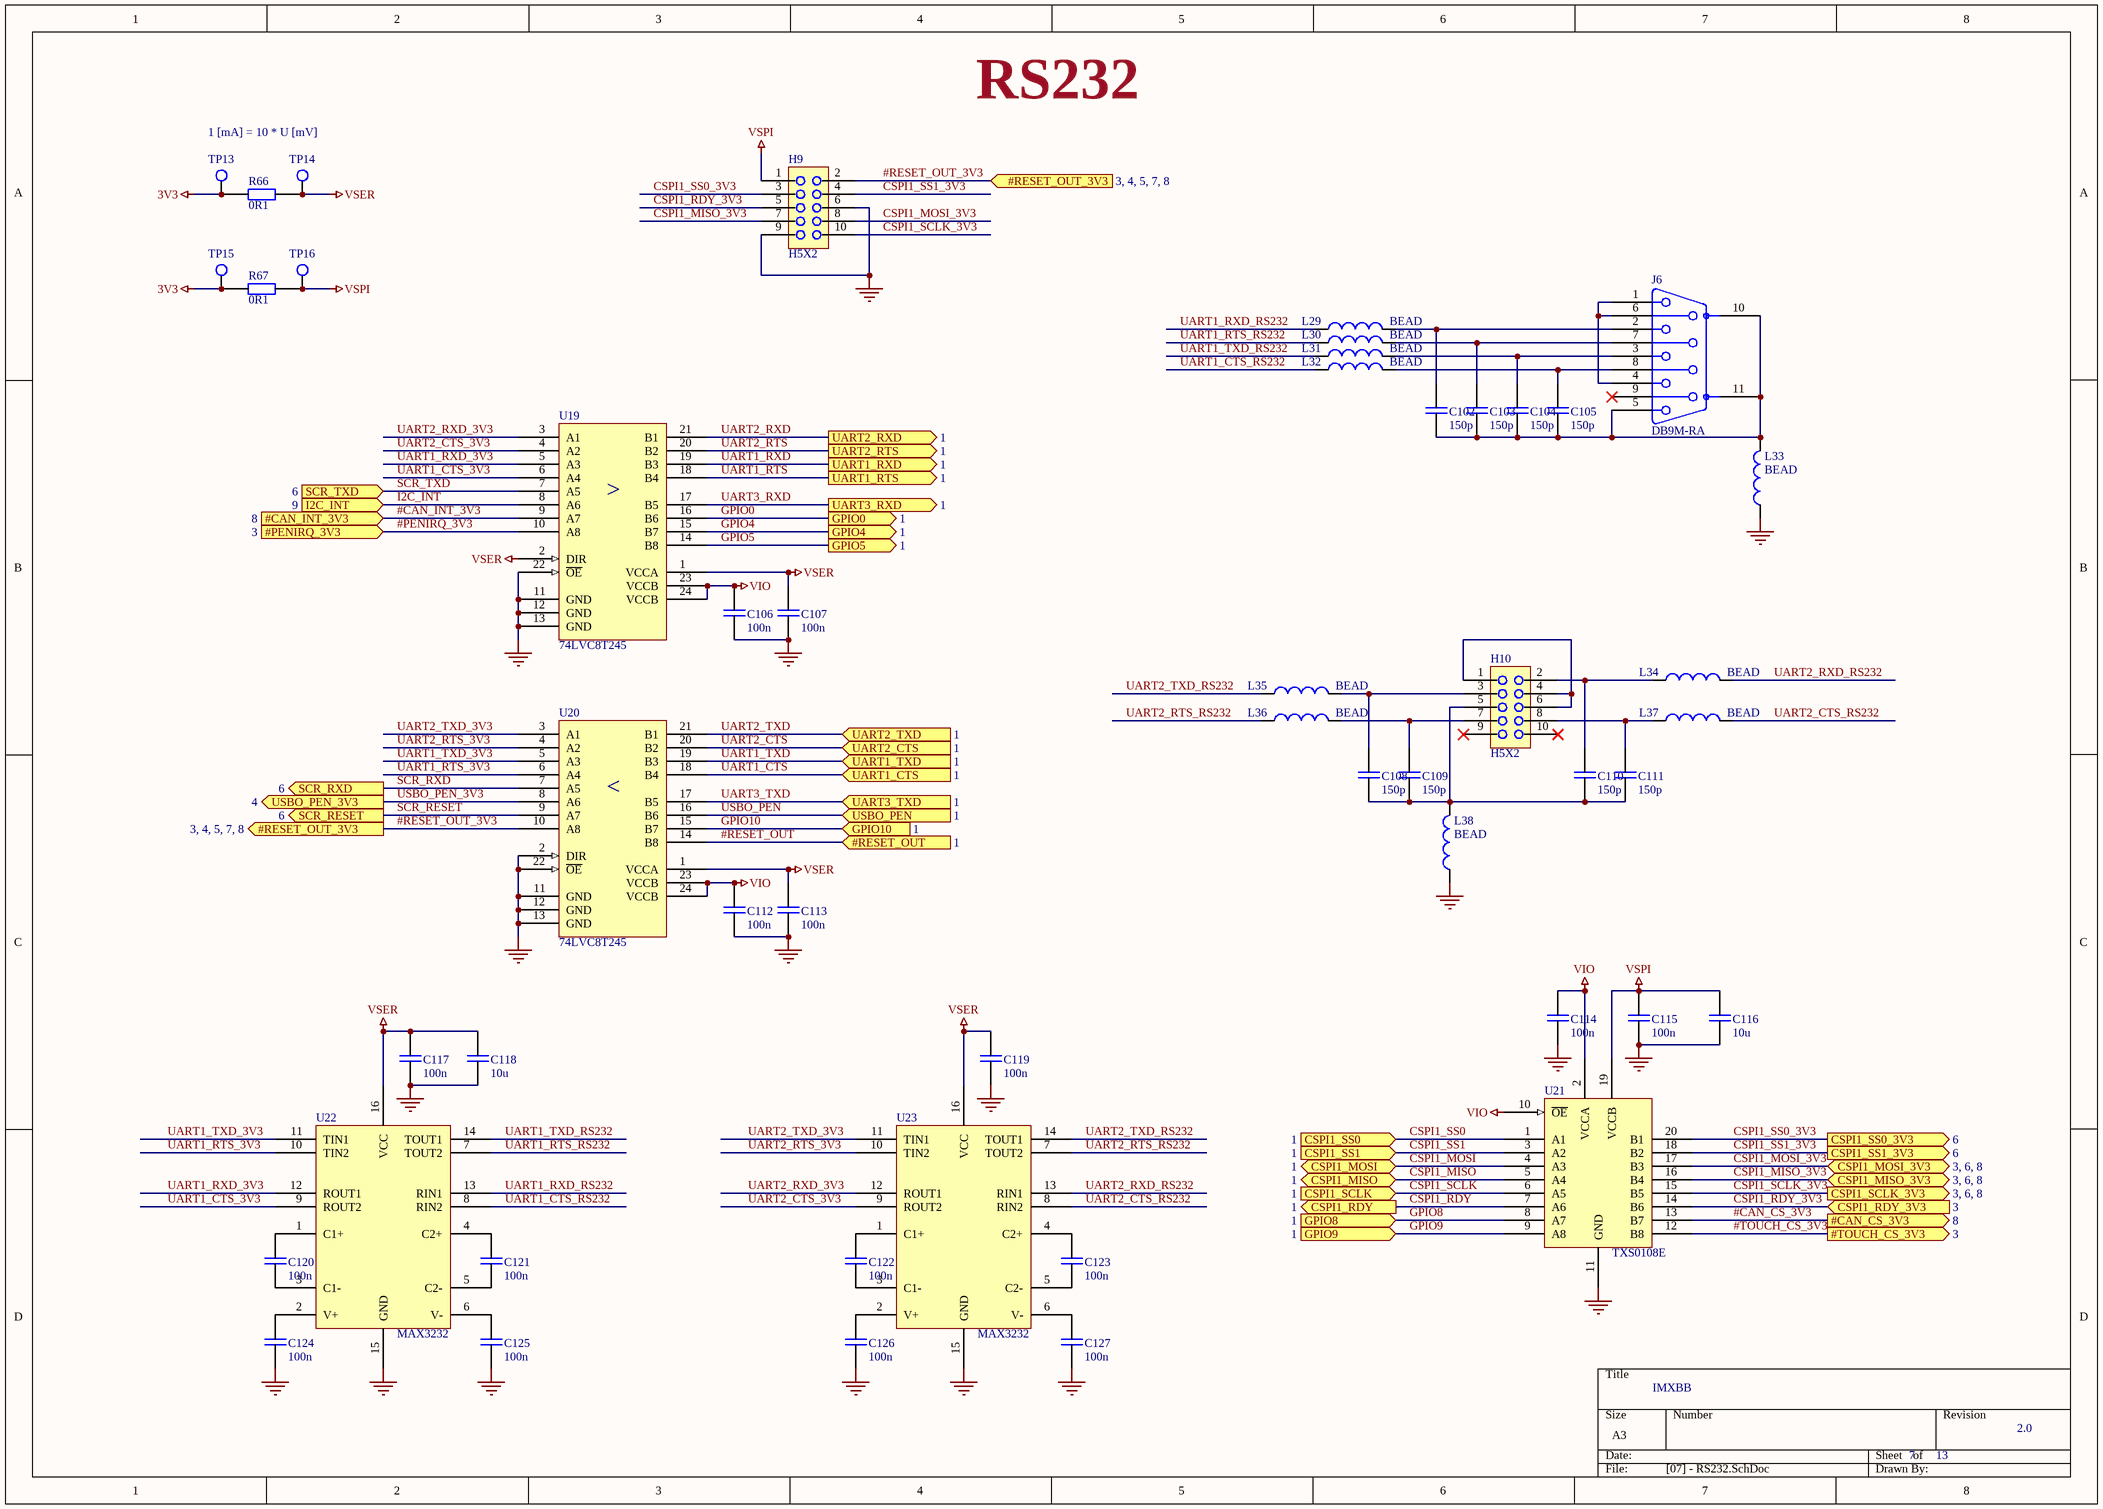
[diagram p7: [07] - RS232.SchDoc]

### Parts
C102  150p  [0603]
C103  150p  [0603]
C104  150p  [0603]
C105  150p  [0603]
C106  100n  [0603]
C107  100n  [0603]
C108  150p  [0603]
C109  150p  [0603]
C110  150p  [0603]
C111  150p  [0603]
C112  100n  [0603]
C113  100n  [0603]
C114  100n  [0603]
C115  100n  [0603]
C116  10u  [0805]
C117  100n  [0603]
C118  10u  [0805]
C119  100n  [0603]
C120  100n  [0603]
C121  100n  [0603]
C122  100n  [0603]
C123  100n  [0603]
C124  100n  [0603]
C125  100n  [0603]
C126  100n  [0603]
C127  100n  [0603]
H9  H5X2  [H2x5]
H10  H5X2  [H2x5]
J6  DB9M-RA  [DRA9_M_RA]
L29  BEAD  [0603]
L30  BEAD  [0603]
L31  BEAD  [0603]
L32  BEAD  [0603]
L33  BEAD  [0603]
L34  BEAD  [0603]
L35  BEAD  [0603]
L36  BEAD  [0603]
L37  BEAD  [0603]
L38  BEAD  [0603]
R66  0R1  [0603]
R67  0R1  [0603]
TP13  TESTPOINT  [TESTPOINT_2mm]  (value not drawn)
TP14  TESTPOINT  [TESTPOINT_2mm]  (value not drawn)
TP15  TESTPOINT  [TESTPOINT_2mm]  (value not drawn)
TP16  TESTPOINT  [TESTPOINT_2mm]  (value not drawn)
U19  74LVC8T245  [TSSOP24]
U20  74LVC8T245  [TSSOP24]
U21  TXS0108E  [TSSOP20]
U22  MAX3232  [SOIC16N]
U23  MAX3232  [SOIC16N]

### Ports
#CAN_CS_3V3 (out, see 8), #CAN_INT_3V3 (in, see 8), #PENIRQ_3V3 (in, see 3), #RESET_OUT (in, see 1), #RESET_OUT_3V3 (in, see 3, 4, 5, 7, 8), #RESET_OUT_3V3 (out, see 3, 4, 5, 7, 8), #TOUCH_CS_3V3 (out, see 3), CSPI1_MISO (bidir, see 1), CSPI1_MISO_3V3 (bidir, see 3, 6, 8), CSPI1_MOSI (bidir, see 1), CSPI1_MOSI_3V3 (bidir, see 3, 6, 8), CSPI1_RDY (out, see 1), CSPI1_RDY_3V3 (in, see 3), CSPI1_SCLK (in, see 1), CSPI1_SCLK_3V3 (out, see 3, 6, 8), CSPI1_SS0 (in, see 1), CSPI1_SS0_3V3 (out, see 6), CSPI1_SS1 (in, see 1), CSPI1_SS1_3V3 (out, see 6), GPIO0 (out, see 1), GPIO4 (out, see 1), GPIO5 (out, see 1), GPIO8 (in, see 1), GPIO9 (in, see 1), GPIO10 (in, see 1), I2C_INT (in, see 9), SCR_RESET (out, see 6), SCR_RXD (out, see 6), SCR_TXD (in, see 6), UART1_CTS (in, see 1), UART1_RTS (out, see 1), UART1_RXD (out, see 1), UART1_TXD (in, see 1), UART2_CTS (in, see 1), UART2_RTS (out, see 1), UART2_RXD (out, see 1), UART2_TXD (in, see 1), UART3_RXD (out, see 1), UART3_TXD (in, see 1), USBO_PEN (in, see 1), USBO_PEN_3V3 (out, see 4)

### Nets
3V3: R66.1 R67.1 TP13.1 TP15.1
GND: C106.1 C107.1 C112.1 C113.1 C114.1 C115.1 C116.1 C117.1 C118.1 C119.1 C124.1 C125.1 C126.1 C127.1 H9.6 H9.9 L33.1 L38.1 U19.11(GND) U19.12(GND) U19.13(GND) U19.22(~{OE}) U20.2(DIR) U20.11(GND) U20.12(GND) U20.13(GND) U20.22(~{OE}) U21.11(GND) U22.15(GND) U23.15(GND)
VIO: C106.2 C112.2 C114.2 U19.23(VCCB) U19.24(VCCB) U20.23(VCCB) U20.24(VCCB) U21.2(VCCA) U21.10(~{OE})
VSER: C107.2 C113.2 C117.2 C118.2 C119.2 R66.2 TP14.1 U19.1(VCCA) U19.2(DIR) U20.1(VCCA) U22.16(VCC) U23.16(VCC)
VSPI: C115.2 C116.2 H9.1 R67.2 TP16.1 U21.19(VCCB)
#CAN_CS_3V3: U21.13(B7) ; port #CAN_CS_3V3
#CAN_INT_3V3: U19.9(A7) ; port #CAN_INT_3V3
#PENIRQ_3V3: U19.10(A8) ; port #PENIRQ_3V3
#RESET_OUT: U20.14(B8) ; port #RESET_OUT
#RESET_OUT_3V3: H9.2 U20.10(A8) ; port #RESET_OUT_3V3
#TOUCH_CS_3V3: U21.12(B8) ; port #TOUCH_CS_3V3
CSPI1_MISO: U21.5(A4) ; port CSPI1_MISO
CSPI1_MISO_3V3: H9.7 U21.16(B4) ; port CSPI1_MISO_3V3
CSPI1_MOSI: U21.4(A3) ; port CSPI1_MOSI
CSPI1_MOSI_3V3: H9.8 U21.17(B3) ; port CSPI1_MOSI_3V3
CSPI1_RDY: U21.7(A6) ; port CSPI1_RDY
CSPI1_RDY_3V3: H9.5 U21.14(B6) ; port CSPI1_RDY_3V3
CSPI1_SCLK: U21.6(A5) ; port CSPI1_SCLK
CSPI1_SCLK_3V3: H9.10 U21.15(B5) ; port CSPI1_SCLK_3V3
CSPI1_SS0: U21.1(A1) ; port CSPI1_SS0
CSPI1_SS0_3V3: H9.3 U21.20(B1) ; port CSPI1_SS0_3V3
CSPI1_SS1: U21.3(A2) ; port CSPI1_SS1
CSPI1_SS1_3V3: H9.4 U21.18(B2) ; port CSPI1_SS1_3V3
GPIO0: U19.16(B6) ; port GPIO0
GPIO4: U19.15(B7) ; port GPIO4
GPIO5: U19.14(B8) ; port GPIO5
GPIO8: U21.8(A7) ; port GPIO8
GPIO9: U21.9(A8) ; port GPIO9
GPIO10: U20.15(B7) ; port GPIO10
I2C_INT: U19.8(A6) ; port I2C_INT
SCR_RESET: U20.9(A7) ; port SCR_RESET
SCR_RXD: U20.7(A5) ; port SCR_RXD
SCR_TXD: U19.7(A5) ; port SCR_TXD
UART1_CTS: U20.18(B4) ; port UART1_CTS
UART1_CTS_3V3: U19.6(A4) U22.9(ROUT2)
UART1_CTS_RS232: L32.1 U22.8(RIN2)
UART1_RTS: U19.18(B4) ; port UART1_RTS
UART1_RTS_3V3: U20.6(A4) U22.10(TIN2)
UART1_RTS_RS232: L30.1 U22.7(TOUT2)
UART1_RXD: U19.19(B3) ; port UART1_RXD
UART1_RXD_3V3: U19.5(A3) U22.12(ROUT1)
UART1_RXD_RS232: L29.1 U22.13(RIN1)
UART1_TXD: U20.19(B3) ; port UART1_TXD
UART1_TXD_3V3: U20.5(A3) U22.11(TIN1)
UART1_TXD_RS232: L31.1 U22.14(TOUT1)
UART2_CTS: U20.20(B2) ; port UART2_CTS
UART2_CTS_3V3: U19.4(A2) U23.9(ROUT2)
UART2_CTS_RS232: L37.2 U23.8(RIN2)
UART2_RTS: U19.20(B2) ; port UART2_RTS
UART2_RTS_3V3: U20.4(A2) U23.10(TIN2)
UART2_RTS_RS232: L36.1 U23.7(TOUT2)
UART2_RXD: U19.21(B1) ; port UART2_RXD
UART2_RXD_3V3: U19.3(A1) U23.12(ROUT1)
UART2_RXD_RS232: L34.2 U23.13(RIN1)
UART2_TXD: U20.21(B1) ; port UART2_TXD
UART2_TXD_3V3: U20.3(A1) U23.11(TIN1)
UART2_TXD_RS232: L35.1 U23.14(TOUT1)
UART3_RXD: U19.17(B5) ; port UART3_RXD
UART3_TXD: U20.17(B5) ; port UART3_TXD
USBO_PEN: U20.16(B6) ; port USBO_PEN
USBO_PEN_3V3: U20.8(A6) ; port USBO_PEN_3V3
NetC102_1: C102.1 C103.1 C104.1 C105.1 J6.5 J6.10(SHIELD) J6.11(SHIELD) L33.2
NetC102_2: C102.2 J6.2 L29.2
NetC103_2: C103.2 J6.7 L30.2
NetC104_2: C104.2 J6.3 L31.2
NetC105_2: C105.2 J6.8 L32.2
NetC108_1: C108.1 C109.1 C110.1 C111.1 H10.5 L38.2
NetC108_2: C108.2 H10.3 L35.2
NetC109_2: C109.2 H10.7 L36.2
NetC110_2: C110.2 H10.2 L34.1
NetC111_2: C111.2 H10.8 L37.1
NetC120_1: C120.1 U22.3(C1-)
NetC120_2: C120.2 U22.1(C1+)
NetC121_1: C121.1 U22.5(C2-)
NetC121_2: C121.2 U22.4(C2+)
NetC122_1: C122.1 U23.3(C1-)
NetC122_2: C122.2 U23.1(C1+)
NetC123_1: C123.1 U23.5(C2-)
NetC123_2: C123.2 U23.4(C2+)
NetC124_2: C124.2 U22.2(V+)
NetC125_2: C125.2 U22.6(V-)
NetC126_2: C126.2 U23.2(V+)
NetC127_2: C127.2 U23.6(V-)
NetH10_1: H10.1 H10.4 H10.6
NetJ6_1: J6.1 J6.4 J6.6

Not connected (* = marked no-connect by the designer): H10 9* 10*; J6 9(17)*

### Notes on the sheet
- RS232
- 1 [mA] = 10 * U [mV]
- (near U19) >
- (near U20) <

### Library data of the parts
C102-C127 = C
L29-L38 = FBEAD
R66 R67 = R
TP13-TP16 = TESTPOINT: as TP1 on sheet [03] - DIMM CON; Component class: TP; Producer: n/a; Assembly type: no component